# EAGLE design OpenBook (EAGLE 9.7.0)
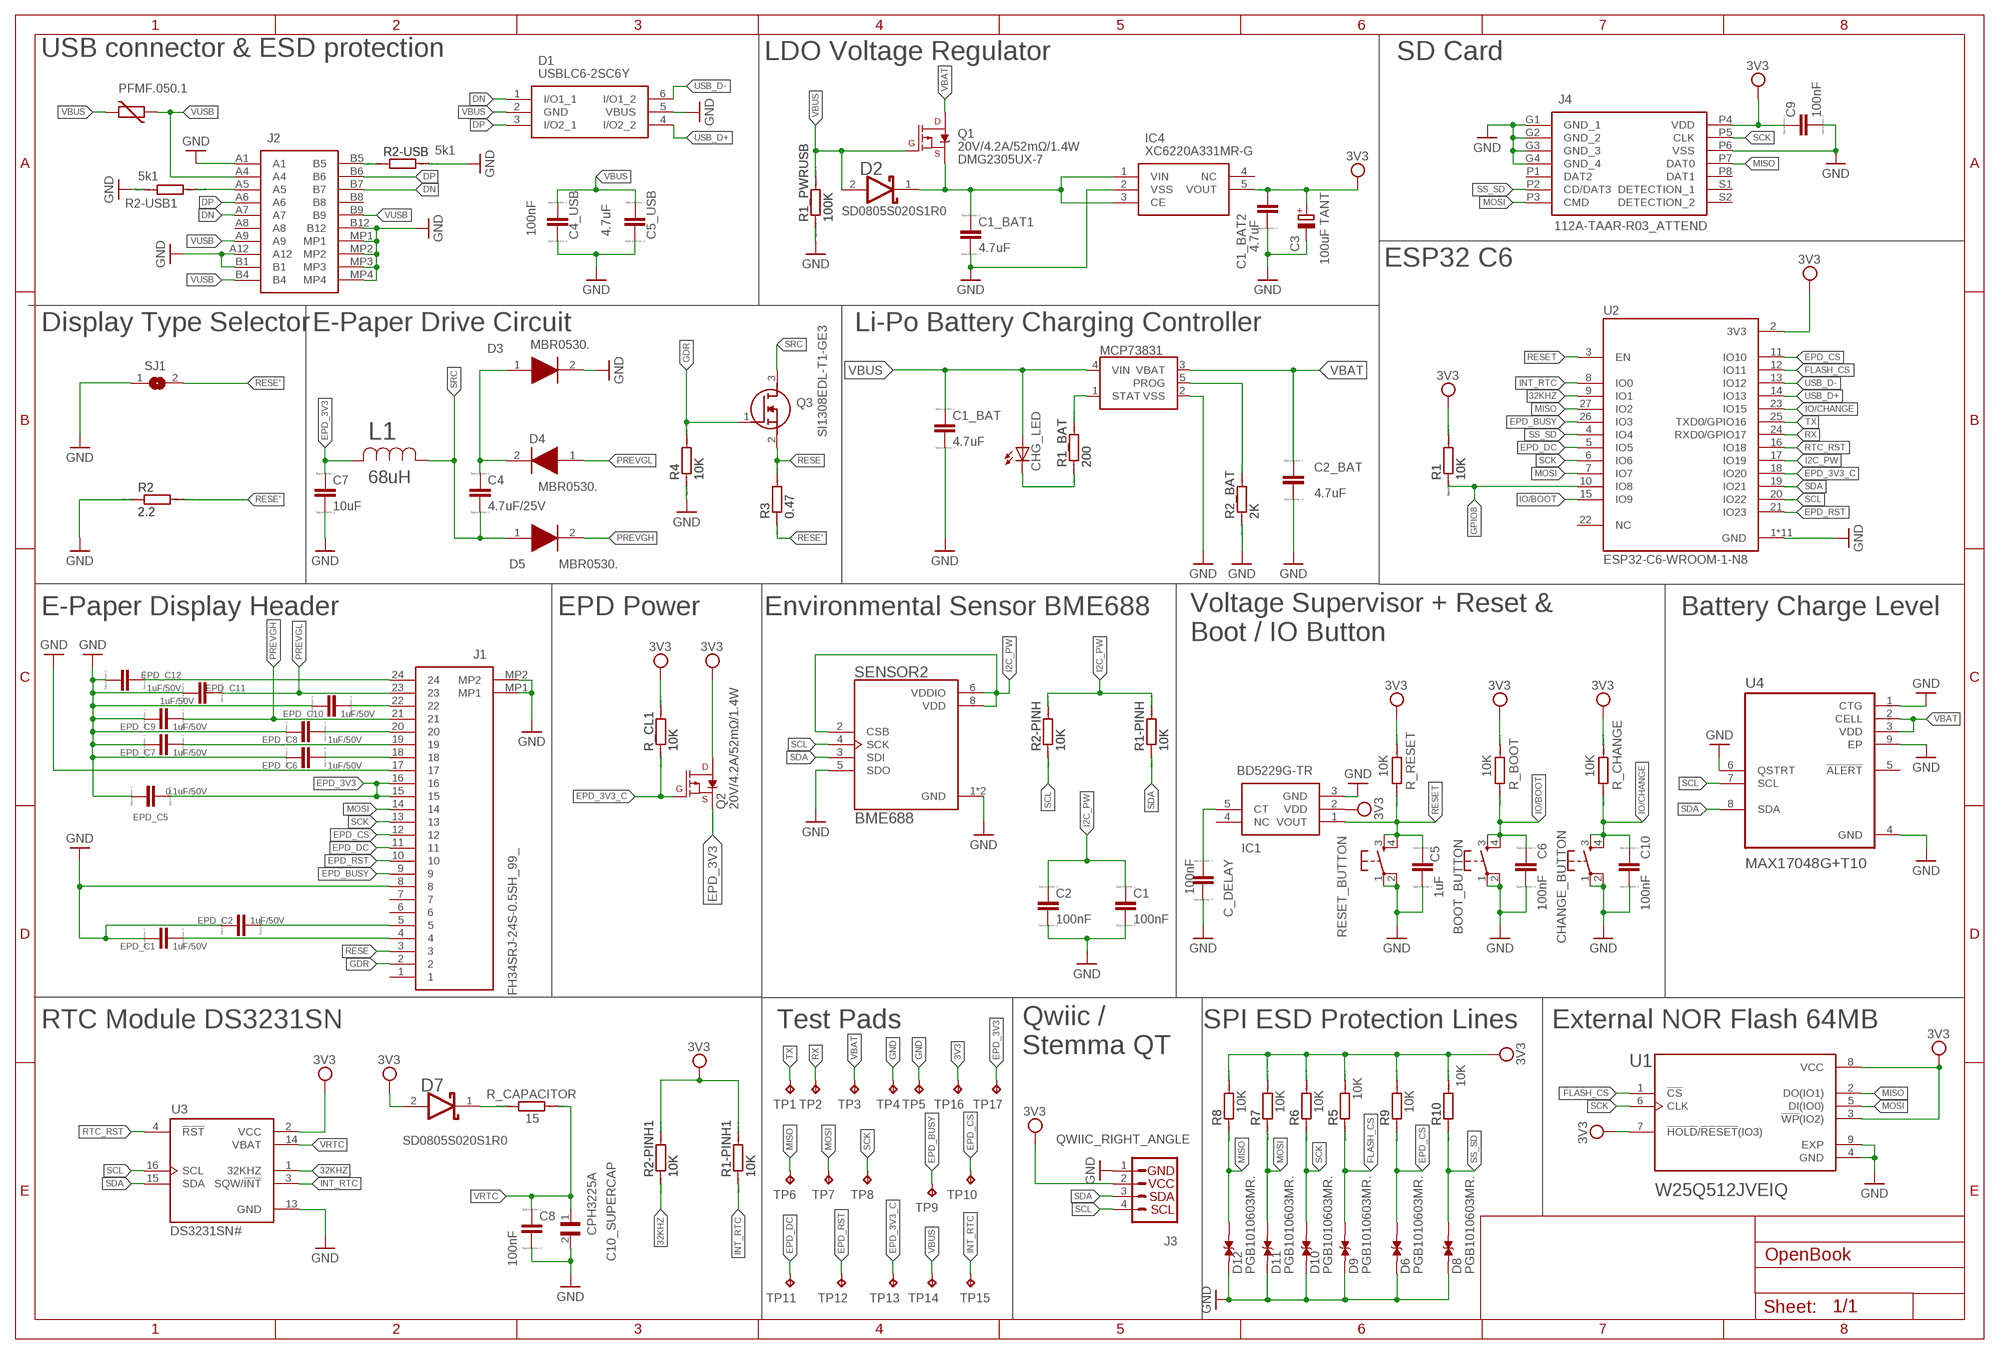
[diagram p0: schematic, sheet 1]

## Parts
BOOT_BUTTON  BUTTON_CUSYOMV1V2  [MYBUTTON]
C1  100nF  EAGLE-LTSPICE_C  [EAGLE-LTSPICE_C0402]
C1_BAT  4.7uF  EAGLE-LTSPICE_C  [EAGLE-LTSPICE_C0402]
C1_BAT1  4.7uF  EAGLE-LTSPICE_C  [EAGLE-LTSPICE_C0402]
C1_BAT2  4.7uF  EAGLE-LTSPICE_C  [EAGLE-LTSPICE_C0402]
C2  100nF  EAGLE-LTSPICE_C  [EAGLE-LTSPICE_C0402]
C2_BAT  4.7uF  EAGLE-LTSPICE_C  [EAGLE-LTSPICE_C0402]
C3  100uF TANT  RCL_CPOL-EUCT3528  [RCL_CT3528]
C4  4.7uF/25V  EAGLE-LTSPICE_C  [EAGLE-LTSPICE_C0402]
C4_USB  100nF  EAGLE-LTSPICE_C  [EAGLE-LTSPICE_C0402]
C5  1uF  EAGLE-LTSPICE_C  [EAGLE-LTSPICE_C0402]
C5_USB  4.7uF  EAGLE-LTSPICE_C  [EAGLE-LTSPICE_C0402]
C6  100nF  EAGLE-LTSPICE_C  [EAGLE-LTSPICE_C0402]
C7  10uF  EAGLE-LTSPICE_C  [EAGLE-LTSPICE_C0402]
C8  100nF  EAGLE-LTSPICE_C  [EAGLE-LTSPICE_C0402]
C9  100nF  EAGLE-LTSPICE_C  [EAGLE-LTSPICE_C0402]
C10  100nF  EAGLE-LTSPICE_C  [EAGLE-LTSPICE_C0402]
C10_SUPERCAP  CPH3225A  [CAPCP3225X100N]
C_DELAY  100nF  EAGLE-LTSPICE_C  [EAGLE-LTSPICE_C0402]
CHANGE_BUTTON  BUTTON_CUSYOMV1V2  [MYBUTTON]
CHG_LED  ADAFRUIT_LEDCHIP-LED0603  [ADAFRUIT_CHIP-LED0603]
D1  USBLC6-2SC6Y  [SOT95P280X145-6N]
D2  SD0805S020S1R0  ESP32_WROVER_AVX---SD0805S020S1R0_AVX_SD0805S020S1R0_0_0AVX_SD0805S020S1R0_0_0  [ESP32_WROVER_AVX---SD0805S020S1R0_AVX_SD0805S020S1R0_0]
D3  MBR0530.  [SOD3716X135N]
D4  MBR0530.  [SOD3716X135N]
D5  MBR0530.  [SOD3716X135N]
D6  PGB1010603MR.  [DIOC1608X36N]
D7  SD0805S020S1R0  ESP32_WROVER_AVX---SD0805S020S1R0_AVX_SD0805S020S1R0_0_0AVX_SD0805S020S1R0_0_0  [ESP32_WROVER_AVX---SD0805S020S1R0_AVX_SD0805S020S1R0_0]
D8  PGB1010603MR.  [DIOC1608X36N]
D9  PGB1010603MR.  [DIOC1608X36N]
D10  PGB1010603MR.  [DIOC1608X36N]
D11  PGB1010603MR.  [DIOC1608X36N]
D12  PGB1010603MR.  [DIOC1608X36N]
EPD_C1  1uF/50V  EAGLE-LTSPICE_C  [EAGLE-LTSPICE_C0402]
EPD_C2  1uF/50V  EAGLE-LTSPICE_C  [EAGLE-LTSPICE_C0402]
EPD_C5  0.1uF/50V  EAGLE-LTSPICE_C  [EAGLE-LTSPICE_C0402]
EPD_C6  1uF/50V  EAGLE-LTSPICE_C  [EAGLE-LTSPICE_C0402]
EPD_C7  1uF/50V  EAGLE-LTSPICE_C  [EAGLE-LTSPICE_C0402]
EPD_C8  1uF/50V  EAGLE-LTSPICE_C  [EAGLE-LTSPICE_C0402]
EPD_C9  1uF/50V  EAGLE-LTSPICE_C  [EAGLE-LTSPICE_C0402]
EPD_C10  1uF/50V  EAGLE-LTSPICE_C  [EAGLE-LTSPICE_C0402]
EPD_C11  1uF/50V  EAGLE-LTSPICE_C  [EAGLE-LTSPICE_C0402]
EPD_C12  1uF/50V  EAGLE-LTSPICE_C  [EAGLE-LTSPICE_C0402]
IC1  BD5229G-TR  [SOT95P280X125-5N]
IC4  XC6220A331MR-G  [SOT95P280X120-5N]
J1  FH34SRJ-24S-0.5SH_99_  [FH34SRJ24S05SH99]
J2  SAMACSYS_PARTS_USB4110-GF-A  [SAMACSYS_PARTS_USB4110GFA]
J3  QWIIC_RIGHT_ANGLE  QWIIC_CONNECTORJS-1MM  [JST04_1MM_RA]
J4  112A-TAAR-R03_ATTEND  [112ATAARR03ATTEND]
L1  68uH  744043680IND_4828-WE-TPC_WRE  [IND_4828-WE-TPC_WRE]
MCP73831  ESP32_WROVER_SPARKFUN-IC-POWER_MCP73831  [ESP32_WROVER_SPARKFUN-IC-POWER_SOT23-5]
PFMF.050.1  ESP32C6_VARISTORCN1812  [ESP32C6_VARISTOR_CT/CN1812]
Q1  20V/4.2A/52mΩ/1.4W  ESP32_WROVER_SPARKFUN-DISCRETESEMI_MOSFET_PCH-DMG2305UX-7  [ESP32_WROVER_SPARKFUN-DISCRETESEMI_SOT23-3]
Q2  20V/4.2A/52mΩ/1.4W  ESP32_WROVER_SPARKFUN-DISCRETESEMI_MOSFET_PCH-DMG2305UX-7  [ESP32_WROVER_SPARKFUN-DISCRETESEMI_SOT23-3]
Q3  SI1308EDL-T1-GE3  [SOT65P210X110-3N]
R1  10K  ESP32_WROVER_EAGLE-LTSPICE_R  [ESP32_WROVER_EAGLE-LTSPICE_R0402]
R1-PINH  10K  ESP32_WROVER_EAGLE-LTSPICE_R  [ESP32_WROVER_EAGLE-LTSPICE_R0402]
R1-PINH1  10K  ESP32_WROVER_EAGLE-LTSPICE_R  [ESP32_WROVER_EAGLE-LTSPICE_R0402]
R1_BAT  200  ESP32_WROVER_EAGLE-LTSPICE_R  [ESP32_WROVER_EAGLE-LTSPICE_R0402]
R1_PWRUSB  100K  ESP32_WROVER_EAGLE-LTSPICE_R  [ESP32_WROVER_EAGLE-LTSPICE_R0402]
R2  2.2  ESP32_WROVER_EAGLE-LTSPICE_R  [ESP32_WROVER_EAGLE-LTSPICE_R0402]
R2-PINH  10K  ESP32_WROVER_EAGLE-LTSPICE_R  [ESP32_WROVER_EAGLE-LTSPICE_R0402]
R2-PINH1  10K  ESP32_WROVER_EAGLE-LTSPICE_R  [ESP32_WROVER_EAGLE-LTSPICE_R0402]
R2-USB  5k1  ESP32_WROVER_EAGLE-LTSPICE_R  [ESP32_WROVER_EAGLE-LTSPICE_R0402]
R2-USB1  5k1  ESP32_WROVER_EAGLE-LTSPICE_R  [ESP32_WROVER_EAGLE-LTSPICE_R0402]
R2_BAT  2K  ESP32_WROVER_EAGLE-LTSPICE_R  [ESP32_WROVER_EAGLE-LTSPICE_R0402]
R3  0.47  ESP32_WROVER_EAGLE-LTSPICE_R  [ESP32_WROVER_EAGLE-LTSPICE_R0402]
R4  10K  ESP32_WROVER_EAGLE-LTSPICE_R  [ESP32_WROVER_EAGLE-LTSPICE_R0402]
R5  10K  ESP32_WROVER_EAGLE-LTSPICE_R  [ESP32_WROVER_EAGLE-LTSPICE_R0402]
R6  10K  ESP32_WROVER_EAGLE-LTSPICE_R  [ESP32_WROVER_EAGLE-LTSPICE_R0402]
R7  10K  ESP32_WROVER_EAGLE-LTSPICE_R  [ESP32_WROVER_EAGLE-LTSPICE_R0402]
R8  10K  ESP32_WROVER_EAGLE-LTSPICE_R  [ESP32_WROVER_EAGLE-LTSPICE_R0402]
R9  10K  ESP32_WROVER_EAGLE-LTSPICE_R  [ESP32_WROVER_EAGLE-LTSPICE_R0402]
R10  10K  ESP32_WROVER_EAGLE-LTSPICE_R  [ESP32_WROVER_EAGLE-LTSPICE_R0402]
R_BOOT  10K  ESP32_WROVER_EAGLE-LTSPICE_R  [ESP32_WROVER_EAGLE-LTSPICE_R0402]
R_CAPACITOR  15  ESP32_WROVER_EAGLE-LTSPICE_R  [ESP32_WROVER_EAGLE-LTSPICE_R0402]
R_CHANGE  10K  ESP32_WROVER_EAGLE-LTSPICE_R  [ESP32_WROVER_EAGLE-LTSPICE_R0402]
R_CL1  10K  ESP32_WROVER_EAGLE-LTSPICE_R  [ESP32_WROVER_EAGLE-LTSPICE_R0402]
R_RESET  10K  ESP32_WROVER_EAGLE-LTSPICE_R  [ESP32_WROVER_EAGLE-LTSPICE_R0402]
RESET_BUTTON  BUTTON_CUSYOMV1V2  [MYBUTTON]
SENSOR2  BME688  ESP32_WROVER_BME680_BME680  [ESP32_WROVER_BME680_PSON80P300X300X100-8N]
SJ1  SJ  [SJ]
TP1  TPV1  [TP20R]
TP2  TPV1  [TP20R]
TP3  TPV1  [TP20R]
TP4  TPV1  [TP20R]
TP5  TPV1  [TP20R]
TP6  TPV1  [TP20R]
TP7  TPV1  [TP20R]
TP8  TPV1  [TP20R]
TP9  TPV1  [TP20R]
TP10  TPV1  [TP20R]
TP11  TPV1  [TP20R]
TP12  TPV1  [TP20R]
TP13  TPV1  [TP20R]
TP14  TPV1  [TP20R]
TP15  TPV1  [TP20R]
TP16  TPV1  [TP20R]
TP17  TPV1  [TP20R]
U1  W25Q512JVEIQ  [SON127P600X800X80-9N]
U2  ESP32-C6-WROOM-1-N8  [XCVR_ESP32-C6-WROOM-1-N8]
U3  DS3231SN#  [SOIC127P1032X265-16N]
U4  MAX17048G+T10  [SON50P200X200X80-9N]

## Nets
3V3 [Alimentare]: C1_BAT2.1 C3.+ C9.1 D7.2(ANODE) IC1.2(VDD) IC4.5(VOUT) J3.2 J4.P4(VDD) Q2.3(D) R1-PINH1.2 R1.2 R2-PINH1.2 R5.2 R6.2 R7.2 R8.2 R9.2 R10.2 R_BOOT.2 R_CHANGE.2 R_CL1.2 R_RESET.2 TP16.TP U1.3(!WP!(IO2)) U1.7(!HOLD!/!RESET!(IO3)) U1.8(VCC) U2.2(3V3) U3.2(VCC)
32KHZ: R2-PINH1.1 U2.9(IO1) U3.1(32KHZ)
DN: D1.1(I/O1_1) J2.A7 J2.B7
DP: D1.3(I/O2_1) J2.A6 J2.B6
EPD_3V3 [Alimentare]: C7.1 EPD_C5.2 J1.15 J1.16 L1.2 Q2.2(S) TP17.TP
EPD_3V3_C [Alimentare]: Q2.1(G) R_CL1.1 TP13.TP U2.18(IO20)
EPD_BUSY: J1.9 TP9.TP U2.26(IO3)
EPD_CS: D6.2 J1.12 R9.1 TP10.TP U2.11(IO10)
EPD_DC: J1.11 TP11.TP U2.5(IO5)
EPD_RST: J1.10 TP12.TP U2.21(IO23)
FLASH_CS: D9.2 R5.1 U1.1(!CS) U2.12(IO11)
GDR: J1.2 Q3.1(G) R4.2
GND: BOOT_BUTTON.1 BOOT_BUTTON.2 C1.2 C1_BAT1.2 C1_BAT2.2 C1_BAT.2 C2.2 C2_BAT.2 C3.- C4_USB.2 C5.2 C5_USB.2 C6.2 C7.2 C8.2 C9.2 C10.2 C10_SUPERCAP.2 C_DELAY.2 CHANGE_BUTTON.1 CHANGE_BUTTON.2 D1.5(VBUS) D3.2(K) D6.1 D8.1 D9.1 D10.1 D11.1 D12.1 EPD_C1.1 EPD_C2.1 EPD_C5.1 EPD_C6.1 EPD_C7.1 EPD_C8.1 EPD_C9.1 EPD_C10.1 EPD_C11.1 EPD_C12.1 IC1.3(GND) IC4.2(VSS) J1.8 J1.17 J1.MP1 J1.MP2 J2.A1 J2.A12 J2.B1 J2.B12 J2.MP1 J2.MP2 J2.MP3 J2.MP4 J3.1 J4.G1(GND_1) J4.G2(GND_2) J4.G3(GND_3) J4.G4(GND_4) J4.P6(VSS) MCP73831.2(VSS) R1_PWRUSB.1 R2-USB1.1 R2-USB.2 R2.1 R2_BAT.1 R4.1 RESET_BUTTON.1 RESET_BUTTON.2 SENSOR2.1(GND) SENSOR2.5(SDO) SENSOR2.7(GND) SJ1.1 TP4.TP TP5.TP U1.4(GND) U1.9(EXP) U2.1(GND) U2.28(GND) U2.29_1(GND) U2.29_2(GND) U2.29_3(GND) U2.29_4(GND) U2.29_5(GND) U2.29_6(GND) U2.29_7(GND) U2.29_8(GND) U2.29_9(GND) U3.13(GND) U4.1(CTG) U4.4(GND) U4.6(QSTRT) U4.9(EP)
GPIO8: R1.1 U2.10(IO8)
I2C_PW: C1.1 C2.1 R1-PINH.2 R2-PINH.2 SENSOR2.2(CSB) SENSOR2.6(VDDIO) SENSOR2.8(VDD) U2.17(IO19)
INT_RTC: R1-PINH1.1 TP15.TP U2.8(IO0) U3.3(SQW/!INT)
IO/BOOT: BOOT_BUTTON.3 BOOT_BUTTON.4 C6.1 R_BOOT.1 U2.15(IO9)
IO/CHANGE: C10.1 CHANGE_BUTTON.3 CHANGE_BUTTON.4 R_CHANGE.1 U2.23(IO15)
MISO: D12.2 J4.P7(DAT0) R8.1 TP6.TP U1.2(DO(IO1)) U2.27(IO2)
MOSI: D11.2 J1.14 J4.P3(CMD) R7.1 TP7.TP U1.5(DI(IO0)) U2.7(IO7)
N$1: D7.1(CATHODE) R_CAPACITOR.1
N$2: J2.A5 R2-USB1.2
N$3: J2.B5 R2-USB.1
N$4: C4.1 D3.1(A) D4.2(K)
N$5: C1_BAT1.1 D2.1(CATHODE) IC4.1(VIN) IC4.3(CE) Q1.2(S)
N$7: MCP73831.1(STAT) R1_BAT.2
N$8: MCP73831.5(PROG) R2_BAT.2
N$9: C_DELAY.1 IC1.5(CT)
N$10: CHG_LED.C R1_BAT.1
N$13: EPD_C1.2 J1.4
N$14: EPD_C2.2 J1.5
N$15: EPD_C6.2 J1.18
N$16: EPD_C7.2 J1.19
N$17: EPD_C10.2 J1.22
N$18: EPD_C8.2 J1.20
N$23: EPD_C12.2 J1.24
PREVGH: D5.2(K) EPD_C9.2 J1.21
PREVGL: D4.1(A) EPD_C11.2 J1.23
RESE: J1.3 Q3.2(S) R3.2
RESE': R2.2 R3.1 SJ1.2
RESET: C5.1 IC1.1(VOUT) R_RESET.1 RESET_BUTTON.3 RESET_BUTTON.4 U2.3(EN)
RTC_RST: U2.16(IO18) U3.4(!RST)
RX: TP2.TP U2.24(RXD0/GPIO17)
SCK: D10.2 J1.13 J4.P5(CLK) R6.1 TP8.TP U1.6(CLK) U2.6(IO6)
SCL: J3.4 R2-PINH.1 SENSOR2.4(SCK) U2.20(IO22) U3.16(SCL) U4.7(SCL)
SDA: J3.3 R1-PINH.1 SENSOR2.3(SDI) U2.19(IO21) U3.15(SDA) U4.8(SDA)
SRC: C4.2 D5.1(A) L1.1 Q3.3(D)
SS_SD: D8.2 J4.P2(CD/DAT3) R10.1 U2.4(IO4)
TX: TP1.TP U2.25(TXD0/GPIO16)
USB_D+: D1.4(I/O2_2) U2.14(IO13)
USB_D-: D1.6(I/O1_2) U2.13(IO12)
VBAT: C2_BAT.1 MCP73831.3(VBAT) Q1.3(D) TP3.TP U4.2(CELL) U4.3(VDD)
VBUS [Alimentare]: C1_BAT.1 C4_USB.1 C5_USB.1 CHG_LED.A D1.2(GND) D2.2(ANODE) MCP73831.4(VIN) PFMF.050.1.2 Q1.1(G) R1_PWRUSB.2 TP14.TP
VRTC: C8.1 C10_SUPERCAP.1 R_CAPACITOR.2 U3.14(VBAT)
VUSB [Alimentare]: J2.A4 J2.A9 J2.B4 J2.B9 PFMF.050.1.1
Unconnected: IC1.4(NC) IC4.4(NC) J1.1 J1.6 J1.7 J2.A8 J2.B8 J4.P1(DAT2) J4.P8(DAT1) J4.S1(DETECTION_1) J4.S2(DETECTION_2) U2.22(NC) U4.5(!ALERT)

## Notes on the sheet
- LDO Voltage Regulator | SD Card
- USB connector & ESD protection
- DMG2305UX-7
- SD0805S020S1R0
- ESP32 C6
- Display Type Selector | E-Paper Drive Circuit | Li-Po Battery Charging Controller
- E-Paper Display Header | EPD Power | Environmental Sensor BME688 | Battery Charge Level
- Boot / IO Button | Voltage Supervisor + Reset &
- RTC Module DS3231SN | Test Pads | SPI ESD Protection Lines | External NOR Flash 64MB
- Qwiic / | Stemma QT
- SD0805S020S1R0

## Library data of the parts
BOOT_BUTTON CHANGE_BUTTON RESET_BUTTON = Piese_tudose:BUTTON_CUSYOMV1
C1 C1_BAT C1_BAT1 C1_BAT2 C2 C2_BAT C4 C4_USB C5 C5_USB C6-C10 C_DELAY EPD_C1 EPD_C2 EPD_C5-EPD_C12 = Piese_tudose:EAGLE-LTSPICE_C: CAPACITOR, European symbol
C3 = Piese_tudose:RCL_CPOL-EU: POLARIZED CAPACITOR, European symbol; SPICEPREFIX: C
C10_SUPERCAP = Piese_tudose:CPH3225A: Cap 0.011F 3.3V 1210 Flat Check availability <https://pricing.snapeda.com/parts/CPH3225A/Seiko%20Instruments/view-part?ref=eda>; AVAILABILITY: Not in stock; CHECK_PRICES: https://www.snapeda.com/parts/CPH3225A/Seiko+Instruments/view-part/?ref=eda; DESCRIPTION: 11 mF (EDLC) Supercapacitor 3.3 V 1210 (3225 Metric) - -; MF: Seiko Instruments; MP: CPH3225A; PACKAGE: 1210 Seiko; PRICE: None; PURCHASE-URL: https://www.snapeda.com/api/url_track_click_mouser/?unipart_id=562593&manufacturer=Seiko Instruments&part_name=CPH3225A&search_term=None; SNAPEDA_LINK: https://www.snapeda.com/parts/CPH3225A/Seiko+Instruments/view-part/?ref=snap
CHG_LED = Piese_tudose:ADAFRUIT_LED: LED OSRAM: - CHIPLED LG R971, LG N971, LY N971, LG Q971, LY Q971, LO R971, LY R971 LH N974, LH R974 LS Q976, LO Q976, LY Q976 LO Q996 - Hyper CHIPLED LW Q18S LB Q993, LB Q99A, LB R99A - SideLED LS A670, LO A670, LY A670, LG A670, LP A670 LB A673, LV A673, LT A673, LW A673 LH A674 LY A675 LS A676, LA A676, LO A676, LY A676, LW A676 LS A679, LY A679, LG A679 - Hyper Micro SIDELED® LS Y876, LA Y876, LO Y876, LY Y876 LT Y87S - SmartLED LW L88C, LW L88S LB L89C, LB L89S, LG L890 LS L89K, LO L89K, LY L89K LS L896, LA L896, LO L896, LY L896 - TOPLED LS T670, LO T670, LY T670, LG T670, LP T670 LSG T670, LSP T670, LSY T670, LOP T670, LYG T670 LG T671, LOG T671, LSG T671 LB T673, LV T673, LT T673, LW T673 LH T674 LS T676, LA T676, LO T676, LY T676, LB T676, LH T676, LSB T676, LW T676 LB T67C, LV T67C, LT T67C, LS T67K, LO T67K, LY T67K, LW E67C LS E67B, LA E67B, LO E67B, LY E67B, LB E67C, LV E67C, LT E67C LW T67C LS T679, LY T679, LG T679 LS T770, LO T770, LY T770, LG T770, LP T770 LB T773, LV T773, LT T773, LW T773 LH T774 LS E675, LA E675, LY E675, LS T675 LS T776, LA T776, LO T776, LY T776, LB T776 LHGB T686 LT T68C, LB T68C - Hyper Mini TOPLED® LB M676 - Mini TOPLED Santana® LG M470 LS M47K, LO M47K, LY M47K Source: http://www.osram.convergy.de/
D1 = Piese_tudose:USBLC6-2SC6Y: Low Cap. ESD Protection Auto SOT-23-6 STMicroelectronics USBLC6-2SC6Y, Dual Uni-Directional TVS Diode Array, 6-Pin SOT-23 Source: Datasheet <https://componentsearchengine.com/Datasheets/1/USBLC6-2SC6Y.pdf> Check availability <https://pricing.snapeda.com/parts/USBLC6-2SC6Y/STMicroelectronics/view-part?ref=eda>; AVAILABILITY: In Stock; CHECK_PRICES: https://www.snapeda.com/parts/USBLC6-2SC6Y/STMicroelectronics/view-part/?ref=eda; DESCRIPTION: 17V Clamp 5A (8/20µs) Ipp Tvs Diode Surface Mount SOT-23-6; MF: STMicroelectronics; MP: USBLC6-2SC6Y; PACKAGE: SOT-23-6 STMicroelectronics; PRICE: None; SNAPEDA_LINK: https://www.snapeda.com/parts/USBLC6-2SC6Y/STMicroelectronics/view-part/?ref=snap
D2 D7 = Piese_tudose:ESP32_WROVER_AVX---SD0805S020S1R0_AVX_SD0805S020S1R0_0_0: Schottky Barrier Rectifier Diode; CENTROID_NOT_SPECIFIED: No; DATASHEET: http://datasheets.avx.com/schottky.pdf; DIGIKEY_DESCRIPTION: DIODE SCHOTTKY 20V 1A 0805; DIGIKEY_PART_NUMBER: 478-7800-1-ND; LEAD_FREE: yes; MF: AVX; MOUSER_PART_NUMBER: 581-SD0805S020S1R0; PACKAGE: 0805 (2012 metric); PREFIX: D; ROHS: yes; TEMPERATURE_RANGE_HIGH: +125°C; TEMPERATURE_RANGE_LOW: -55°C
D3-D5 = Piese_tudose:MBR0530: ON SEMICONDUCTOR - MBR0530 - DIODE, SCHOTTKY, 0.5A, 30V, SOD-123 Source: Datasheet <http://www.onsemi.com/pub/Collateral/MBR0530T1-D.PDF> Check availability <https://pricing.snapeda.com/parts/MBR0530/ON%20Semiconductor/view-part?ref=eda>
D6 D8-D12 = Piese_tudose:PGB1010603MR: Check availability <https://pricing.snapeda.com/parts/PGB1010603MR/Littelfuse%20Inc./view-part?ref=eda>
IC1 = Piese_tudose:BD5229G-TR: Voltage Detector with Adjustable Delay Time: CMOS processes are utilized to develop high precision, low current consumption CMOS reset ICs that allow arbitrary setting of the delay time. The extensive lineup includes both Nch Open Drain and CMOS output types in a wide range of detection voltages (from 2.3V to 6.0V, in 0.1V steps), enabling selection of the ideal solution based on customer requirements. In addition, the entire series is of course both lead-free and RoHS-compliant. Source: Datasheet <https://datasheet.datasheetarchive.com/originals/distributors/Datasheets_SAMA/f2b9741ef86007909f138d561a359946.pdf>; DESCRIPTION: Voltage Detector with Adjustable Delay Time: CMOS processes are utilized to develop high precision, low current consumption CMOS reset ICs that allow arbitrary setting of the delay time. The extensive lineup includes both Nch Open Drain and CMOS output types in a wide range of detection voltages (from 2.3V to 6.0V, in 0.1V steps), enabling selection of the ideal solution based on customer requirements. In addition, the entire series is of course both lead-free and RoHS-compliant.; HEIGHT: 1.25mm; MANUFACTURER_NAME: ROHM Semiconductor; MANUFACTURER_PART_NUMBER: BD5229G-TR; MOUSER_PART_NUMBER: 755-BD5229G-TR; MOUSER_PRICE-STOCK: https://www.mouser.co.uk/ProductDetail/ROHM-Semiconductor/BD5229G-TR?qs=4kLU8WoGk0vvnhrrYwdszw%3D%3D
IC4 = Piese_tudose:XC6220A331MR-G: LDO Voltage Regulators Source: Datasheet <https://www.torexsemi.com/file/xc6220/XC6220.pdf>; DESCRIPTION: LDO Voltage Regulators; HEIGHT: 1.2mm; MANUFACTURER_NAME: Torex; MANUFACTURER_PART_NUMBER: XC6220A331MR-G; MOUSER_PART_NUMBER: 865-XC6220A331MR-G; MOUSER_PRICE-STOCK: https://www.mouser.co.uk/ProductDetail/Torex-Semiconductor/XC6220A331MR-G?qs=AsjdqWjXhJ8ZSWznL1J0gg%3D%3D
J1 = Piese_tudose:FH34SRJ-24S-0.5SH_99_: 24 Position FFC, FPC Connector Contacts, Top and Bottom 0.020" (0.50mm) Surface Mount, Right Angle Source: Datasheet <https://www.hirose.com/en/product/document?clcode=CL0580-1255-6-99&productname=FH34SRJ-24S-0.5SH(99)&series=FH34SRJ&documenttype=2DDrawing&lang=en&documentid=0000990903>; DESCRIPTION: 24 Position FFC, FPC Connector Contacts, Top and Bottom 0.020" (0.50mm) Surface Mount, Right Angle; HEIGHT: 1.1mm; MANUFACTURER_NAME: Hirose; MANUFACTURER_PART_NUMBER: FH34SRJ-24S-0.5SH(99); MOUSER_PART_NUMBER: 798-FH34SRJ24S05SH99; MOUSER_PRICE-STOCK: https://www.mouser.co.uk/ProductDetail/Hirose-Connector/FH34SRJ-24S-0.5SH99?qs=vcbW%252B4%252BSTIpKBl5ap9J8Fw%3D%3D
J2 = Piese_tudose:SAMACSYS_PARTS_USB4110-GF-A: CONN USB 2.0 TYPE-C R/A SMT Source: Datasheet <https://gct.co/files/drawings/usb4110.pdf>; DESCRIPTION: CONN USB 2.0 TYPE-C R/A SMT; HEIGHT: 3.26mm; MANUFACTURER_NAME: GCT (GLOBAL CONNECTOR TECHNOLOGY); MANUFACTURER_PART_NUMBER: USB4110-GF-A; MOUSER_PART_NUMBER: 640-USB4110-GF-A; MOUSER_PRICE-STOCK: https://www.mouser.co.uk/ProductDetail/GCT/USB4110-GF-A?qs=KUoIvG%2F9IlYiZvIXQjyJeA%3D%3D
J3 = Piese_tudose:QWIIC_CONNECTOR: SparkFun I2C Standard Qwiic Connector An SMD 1mm pitch JST connector makes it easy and quick (get it? Qwiic?) to connect I2C devices to each other. The Qwiic system <http://www.sparkfun.com/qwiic> enables fast and solderless connection between popular platforms and various sensors and actuators. We carry 200mm <https://www.sparkfun.com/products/14204>, 100mm <https://www.sparkfun.com/products/14205>, 50mm <https://www.sparkfun.com/products/14206>, and breadboard friendly <https://www.sparkfun.com/products/14207> Qwiic cables. We also offer 10 pcs strips <https://www.sparkfun.com/products/14323> the SMD connectors.; PROD_ID: CONN-13694
J4 = Piese_tudose:112A-TAAR-R03_ATTEND: Micro SD Card Socket, Push-Push Type, Top Mount, SMT, H=1.83mm, 10u Source: Datasheet <https://www.attend.com.tw/data/download/file/112A-TAAR-R03.pdf>; DESCRIPTION: Micro SD Card Socket, Push-Push Type, Top Mount, SMT, H=1.83mm, 10u; HEIGHT: 1.9mm; MANUFACTURER_NAME: ATTEND; MANUFACTURER_PART_NUMBER: 112A-TAAR-R03 ATTEND
L1 = Piese_tudose:744043680; COPYRIGHT: Copyright (C) 2024 Ultra Librarian. All rights reserved.; MANUFACTURER_PART_NUMBER: 744043680; MFR_NAME: Wurth Electronics
MCP73831 = Piese_tudose:ESP32_WROVER_SPARKFUN-IC-POWER_MCP73831: MCP73831T Li-Ion, Li-Pol Controller Miniature single cell, fully integrated Li-Ion, Li-polymer charge management controller Datasheet <http://ww1.microchip.com/downloads/en/DeviceDoc/20001984g.pdf> SparkFun Products: SparkFun ESP32 Thing <https://www.sparkfun.com/products/13907> SparkFun 9DoF Razor IMU M0 <https://www.sparkfun.com/products/14001>; PROD_ID: IC-09995
PFMF.050.1 = Piese_tudose:ESP32C6_VARISTOR: VARISTOR
Q1 Q2 = Piese_tudose:ESP32_WROVER_SPARKFUN-DISCRETESEMI_MOSFET_PCH: P-channel MOSFETs Voltage controlled devices that allow control of high current outputs. SparkFun Products: SparkFun ESP32 Thing <https://www.sparkfun.com/products/13907> SparkFun ESP8266 Thing <https://www.sparkfun.com/products/13231> SparkFun Pi Servo HAT V2 <https://www.sparkfun.com/products/15316> DMG2305UX-7 (20V/4.2A/SOT23-3); PROD_ID: TRAN-14388
Q3 = Piese_tudose:SI1308EDL-T1-GE3: MOSFET N-Ch 30V 1.5A TrenchFET SC70 Vishay Si1308EDL-T1-GE3 N-channel MOSFET Transistor, 1.5 A, 30 V, 3-Pin SC-70 Source: Datasheet <https://componentsearchengine.com/Datasheets/1/SI1308EDL-T1-GE3.pdf> Check availability <https://pricing.snapeda.com/parts/SI1308EDL-T1-GE3/Vishay%20Siliconix/view-part?ref=eda>; AVAILABILITY: In Stock; CHECK_PRICES: https://www.snapeda.com/parts/SI1308EDL-T1-GE3/Vishay+Siliconix/view-part/?ref=eda; DESCRIPTION: Si1308EDL-T1-GE3 N-channel MOSFET Transistor, 1.5 A, 30 V, 3-Pin SC-70 | Siliconix / Vishay SI1308EDL-T1-GE3; MF: Vishay Siliconix; MP: SI1308EDL-T1-GE3; PACKAGE: SOT-323 Vishay Semiconductor; PRICE: None; PURCHASE-URL: https://www.snapeda.com/api/url_track_click_mouser/?unipart_id=274603&manufacturer=Vishay Siliconix&part_name=SI1308EDL-T1-GE3&search_term=None; SNAPEDA_LINK: https://www.snapeda.com/parts/SI1308EDL-T1-GE3/Vishay+Siliconix/view-part/?ref=snap
R1 R1-PINH R1-PINH1 R1_BAT R1_PWRUSB R2 R2-PINH R2-PINH1 R2-USB R2-USB1 R2_BAT R3-R10 R_BOOT R_CAPACITOR R_CHANGE R_CL1 R_RESET = Piese_tudose:ESP32_WROVER_EAGLE-LTSPICE_R: RESISTOR, European symbol
SENSOR2 = Piese_tudose:ESP32_WROVER_BME680_BME680: Integrated Environmental Unit; AVAILABILITY: Unavailable; DESCRIPTION: Integrated Environmental Unit; MF: Bosch Sensortec; MP: BME680; PACKAGE: LGA-8 Bosch Tools; PRICE: None
SJ1 = Piese_tudose:SJ: SMD solder JUMPER
TP1-TP17 = Piese_tudose:TP: Test pad
U1 = Piese_tudose:W25Q512JVEIQ: Check availability <https://pricing.snapeda.com/parts/W25Q512JVEIQ/Winbond%20Electronics/view-part?ref=eda>; AVAILABILITY: In Stock; CHECK_PRICES: https://www.snapeda.com/parts/W25Q512JVEIQ/Winbond+Electronics/view-part/?ref=eda; DESCRIPTION: FLASH - NOR Memory IC 512Mb (64M x 8) SPI - Quad I/O 133 MHz 8-WSON (8x6); MF: Winbond Electronics; MP: W25Q512JVEIQ; PACKAGE: Package; PRICE: None; SNAPEDA_LINK: https://www.snapeda.com/parts/W25Q512JVEIQ/Winbond+Electronics/view-part/?ref=snap
U2 = Piese_tudose:ESP32-C6-WROOM-1-N8: Check availability <https://pricing.snapeda.com/parts/ESP32-C6-WROOM-1-N8/Espressif%20Systems/view-part?ref=eda>; AVAILABILITY: In Stock; CHECK_PRICES: https://www.snapeda.com/parts/ESP32-C6-WROOM-1-N8/Espressif+Systems/view-part/?ref=eda; DESCRIPTION: Multiprotocol Modules ESP32-C6 module, Wi-Fi 6 in 2.4 GHz band, Bluetooth 5, Zigbee 3.0 and Thread. ESP34-WROOM Compatible - ENGINEERING SAMPLE; MF: Espressif Systems; MP: ESP32-C6-WROOM-1-N8; PACKAGE: None; PRICE: None; SNAPEDA_LINK: https://www.snapeda.com/parts/ESP32-C6-WROOM-1-N8/Espressif+Systems/view-part/?ref=snap
U3 = Piese_tudose:DS3231SN#: Real Time Clock Serial 16-Pin SOIC W T/R Check availability <https://pricing.snapeda.com/parts/DS3231SN%23/Analog%20Devices/view-part?ref=eda>; AVAILABILITY: In Stock; CHECK_PRICES: https://www.snapeda.com/parts/DS3231SN%23/Analog+Devices/view-part/?ref=eda; DESCRIPTION: Extremely Accurate I²C-Integrated RTC/TCXO/Crystal; MF: Analog Devices; MP: DS3231SN#; PACKAGE: SOIC-16 Maxim; PRICE: None; PURCHASE-URL: https://www.snapeda.com/api/url_track_click_mouser/?unipart_id=99048&manufacturer=Analog Devices&part_name=DS3231SN#&search_term=None; SNAPEDA_LINK: https://www.snapeda.com/parts/DS3231SN%23/Analog+Devices/view-part/?ref=snap
U4 = Piese_tudose:MAX17048G+T10: Check availability <https://pricing.snapeda.com/parts/MAX17048G%2BT10/Analog%20Devices/view-part?ref=eda>; AVAILABILITY: In Stock; CHECK_PRICES: https://www.snapeda.com/parts/MAX17048G+T10/Analog+Devices/view-part/?ref=eda; DESCRIPTION: 3µA 1-Cell/2-Cell Fuel Gauge with ModelGauge; MF: Analog Devices; MP: MAX17048G+T10; PACKAGE: TDFN-8 Maxim; PRICE: None; PURCHASE-URL: https://www.snapeda.com/api/url_track_click_mouser/?unipart_id=329239&manufacturer=Analog Devices&part_name=MAX17048G+T10&search_term=None; SNAPEDA_LINK: https://www.snapeda.com/parts/MAX17048G+T10/Analog+Devices/view-part/?ref=snap

## Net classes
1 Alimentare: width 0.3 mm

## Board
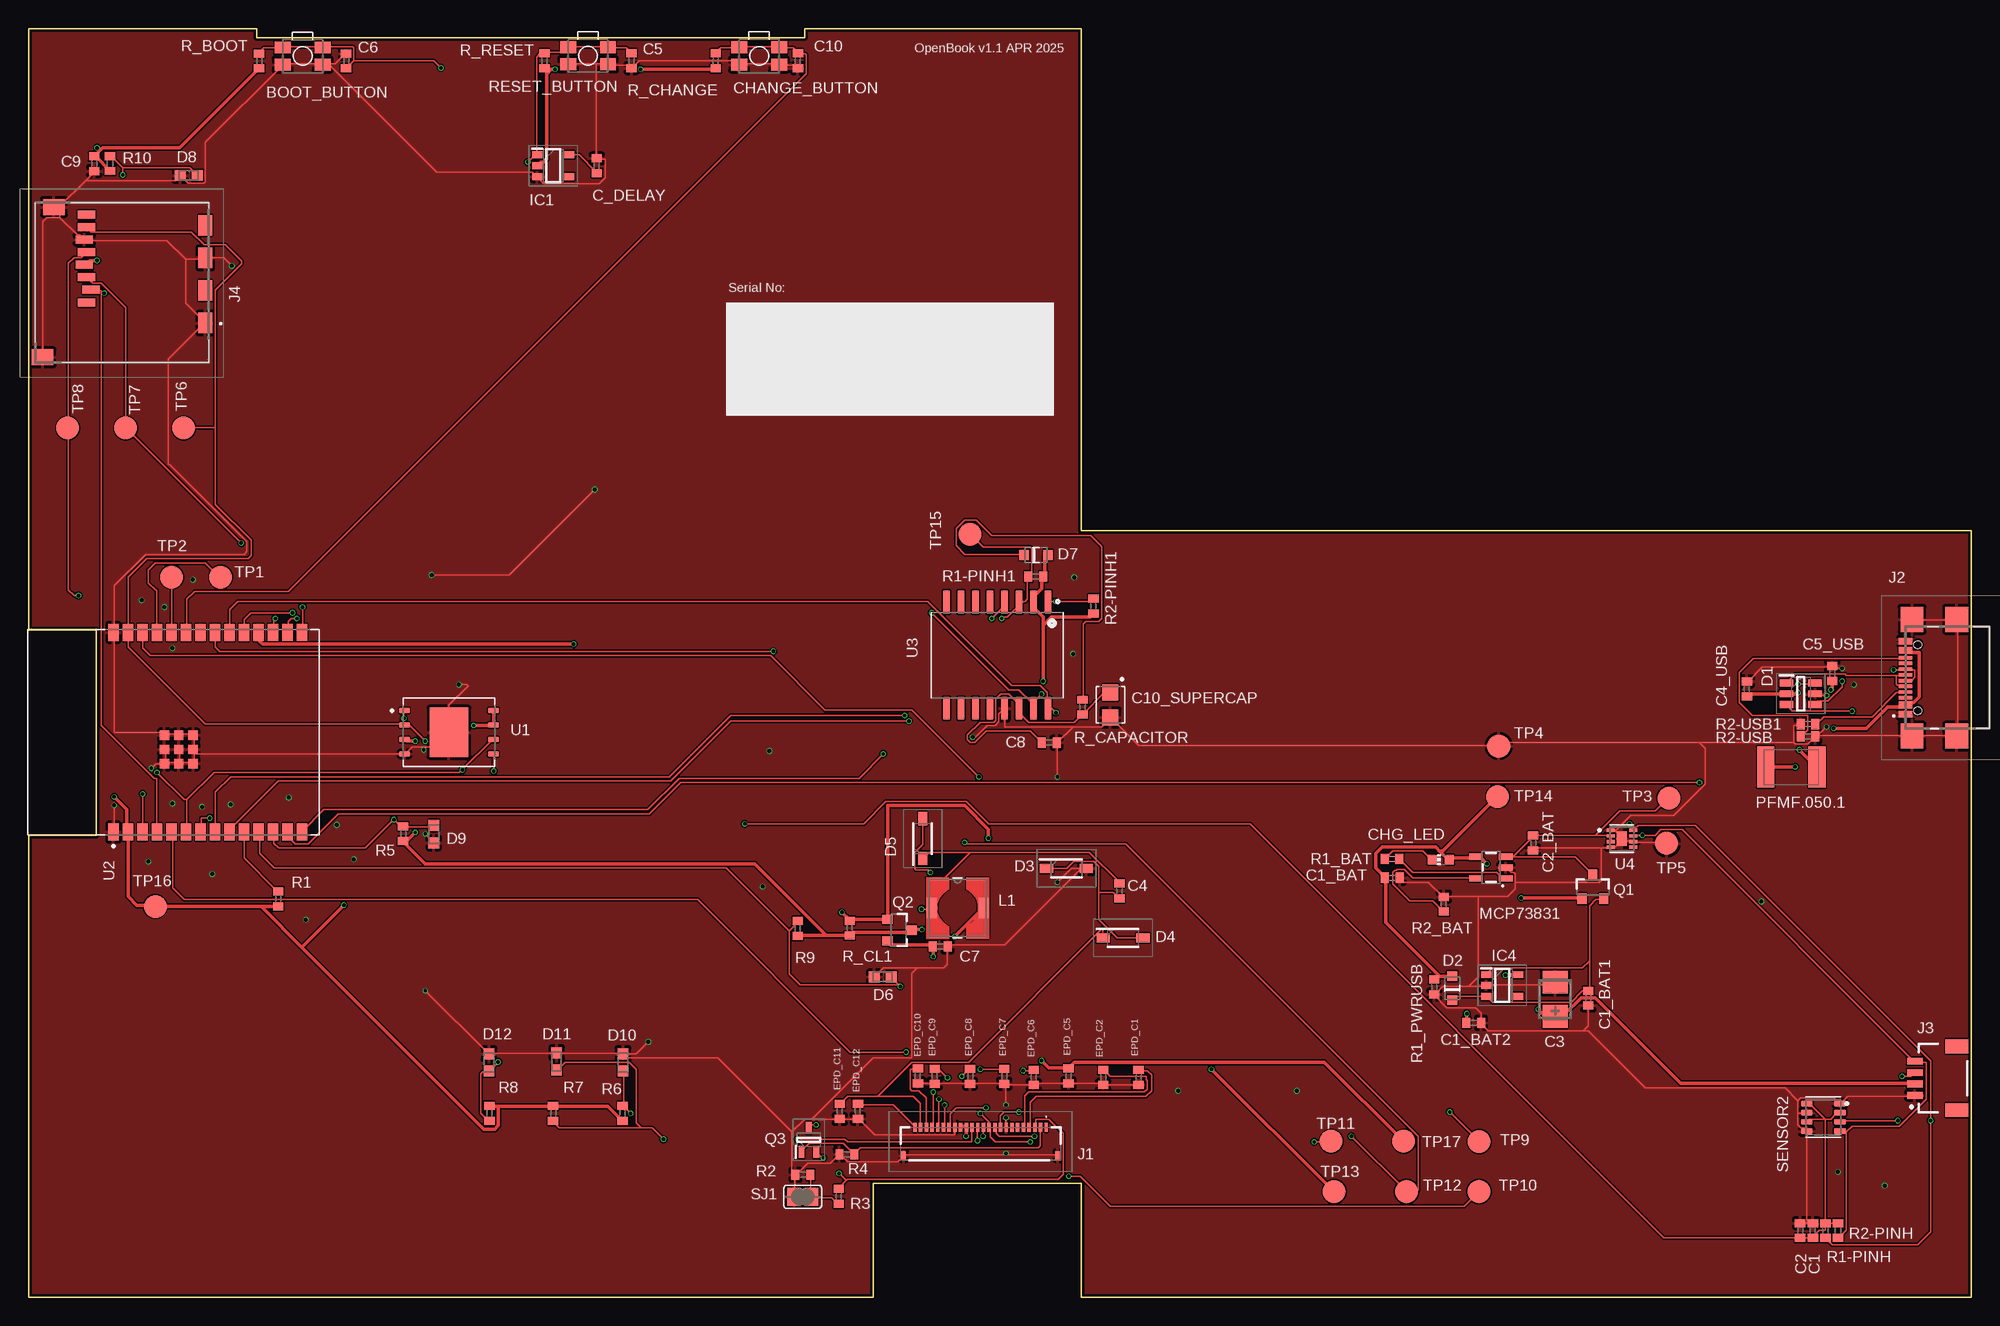
[diagram p1: board, top side]
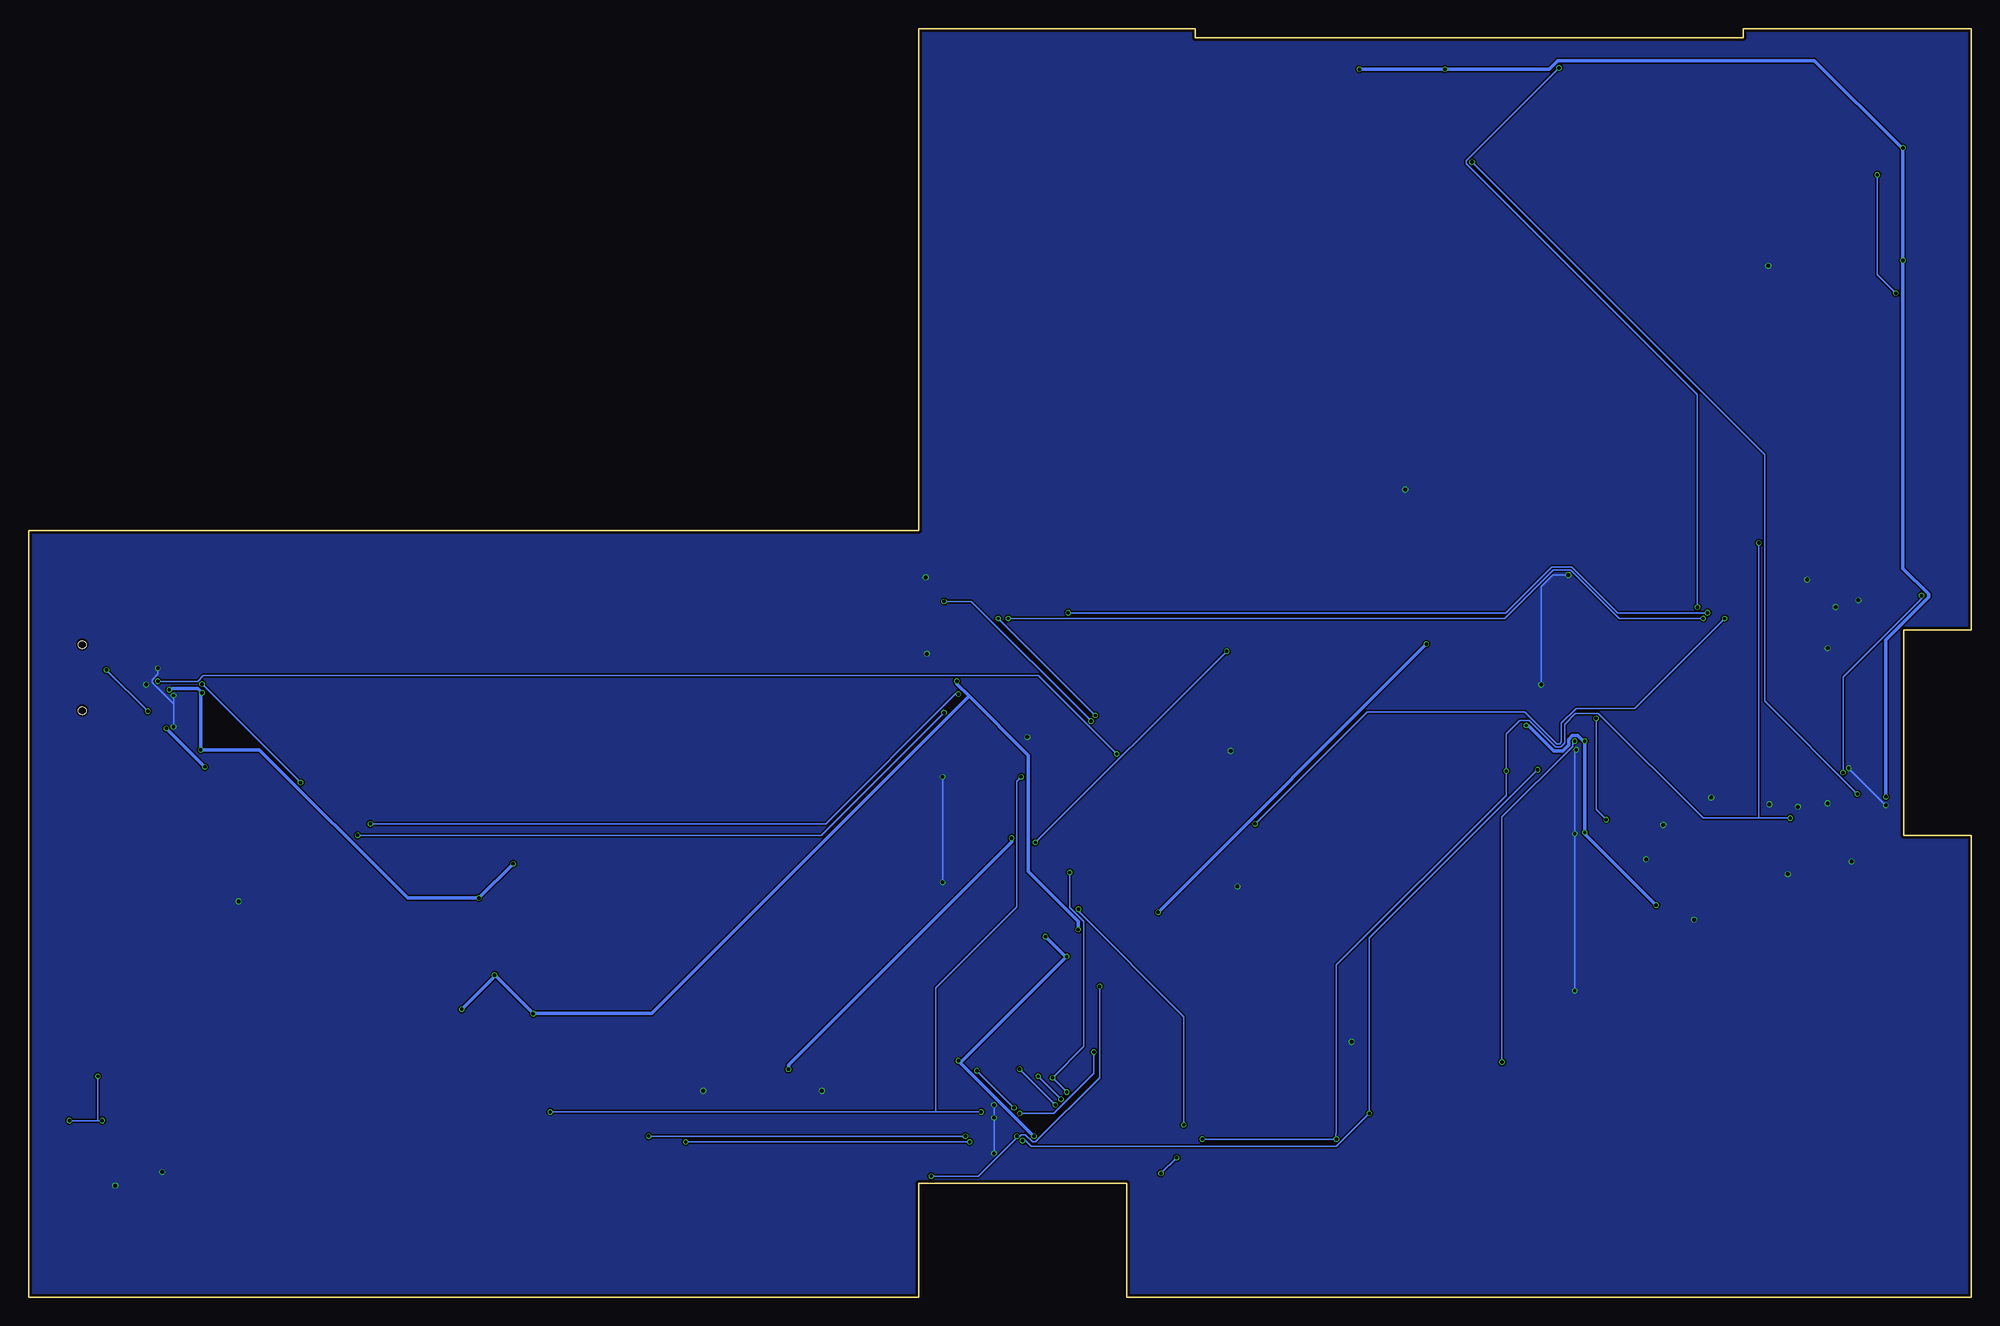
[diagram p2: board, bottom side, seen from below]

Size 170.2 x 111.2 mm. Coordinates in mm from the lower left corner, seen from the top.
Outline: 0,111.2 0,58.51 5.94,58.51 5.94,40.49 0,40.49 0,0 74,0 74,10 92.2,10 92.2,0 170.2,0 170.2,67.2 92.2,67.2 92.2,111.2 68,111.2 68,110.4 20,110.4 20,111.2 0,111.2
Copper layers (1*16): Top 0.035mm / dielectric 1.6mm / Bottom 0.035mm
Design rules "jlcpcb-2layers.dru *": minimum track width 0.15mm, minimum drill 0.3mm, track to track 5mil, track to pad 5mil, pad to pad 5mil, via to via 5mil, smd to smd 5mil, copper to edge 0.2mm, drill to drill 6mil, minimum pad ring 10mil, minimum via ring 3mil, stop-mask expansion 4mil, vias tented up to drill 0mil, thermal gap 10mil

### Footprints (pad centres in the part's own frame; a part is rotated, then mirrored left to right if it is on the bottom)
MYBUTTON = smd 1.4 x 1.05: 1 1.75,0.75; 2 -1.75,0.75; 3 -1.75,-0.75; 4 1.75,-0.75
EAGLE-LTSPICE_C0402 = smd 0.7 x 0.9: 1 -0.65,0; 2 0.65,0
RCL_CT3528 = smd 2 x 2.2: + -1.5,0; - 1.5,0
CAPCP3225X100N = smd 1.4 x 1.4: 1 -1.1,0; 2 1.1,0
ADAFRUIT_CHIP-LED0603 = smd 0.8 x 0.8: A 0,-0.75; C 0,0.75
SOT95P280X145-6N = smd 1.2 x 0.6: 1 -1.25,0.95; 2 -1.25,0; 3 -1.25,-0.95; 4 1.25,-0.95; 5 1.25,0; 6 1.25,0.95
ESP32_WROVER_AVX---SD0805S020S1R0_AVX_SD0805S020S1R0_0 = smd 0.8 x 0.9: 1 -1.05,0; 2 1.05,0
SOD3716X135N = smd 1.15 x 0.8: 1 -1.75,0; 2 1.75,0
DIOC1608X36N = smd 0.97 x 0.94: 1 -0.75,0; 2 0.75,0
SOT95P280X125-5N = smd 0.9 x 0.6: 1 -1.4,0.95; 2 -1.4,0; 3 -1.4,-0.95; 4 1.4,-0.95; 5 1.4,0.95
SOT95P280X120-5N = smd 0.9 x 0.6: 1 -1.4,0.95; 2 -1.4,0; 3 -1.4,-0.95; 4 1.4,-0.95; 5 1.4,0.95
FH34SRJ24S05SH99 = smd 0.3 x 0.8: 1 5.75,1.45; 2 5.25,1.45; 3 4.75,1.45; 4 4.25,1.45; 5 3.75,1.45; 6 3.25,1.45; 7 2.75,1.45; 8 2.25,1.45; 9 1.75,1.45; 10 1.25,1.45; 11 0.75,1.45; 12 0.25,1.45; 13 -0.25,1.45; 14 -0.75,1.45; 15 -1.25,1.45; 16 -1.75,1.45; 17 -2.25,1.45; 18 -2.75,1.45; 19 -3.25,1.45; 20 -3.75,1.45; 21 -4.25,1.45; 22 -4.75,1.45; 23 -5.25,1.45; 24 -5.75,1.45 | smd 0.4 x 0.8: MP1 6.75,-1.05; MP2 -6.75,-1.05
SAMACSYS_PARTS_USB4110GFA = smd 0.3 x 1.15: A1 -3.35,3.678; A4 -2.55,3.678; A5 -1.25,3.678; A6 -0.25,3.678; A7 0.25,3.678; A8 1.25,3.678; A9 2.55,3.678; A12 3.35,3.678; B1 3.05,3.678; B4 2.25,3.678; B5 1.75,3.678; B6 0.75,3.678; B7 -0.75,3.678; B8 -1.75,3.678; B9 -2.25,3.678; B12 -3.05,3.678 | smd 2.18 x 2: MP1 -5.11,-0.827; MP2 5.11,-0.827; MP3 -5.11,3.103; MP4 5.11,3.103 | hole 0.65: -2.89,2.603; 2.89,2.603
JST04_1MM_RA = smd 0.6 x 1.35: 1 -1.5,0; 2 -0.5,0; 3 0.5,0; 4 1.5,0 | smd 1.2 x 2: NC1 2.8,-3.675; NC2 -2.8,-3.675
112ATAARR03ATTEND = smd 1.8 x 1.2: G1 10.6,10.4; G2 4.9,10.4; S1 7.75,10.4; S2 2.05,10.4 | smd 1.4 x 1.9: G3 13.6,-3.85; G4 0.45,-2.85 | smd 0.7 x 1.5: P1 8.8,0; P2 7.7,0.4; P3 6.6,0; P4 5.5,-0.2; P5 4.4,0; P6 3.3,-0.2; P7 2.2,0; P8 1.1,0
IND_4828-WE-TPC_WRE = smd 0.914 x 1.778: 1 -2.286,0; 2 2.286,0
ESP32_WROVER_SPARKFUN-IC-POWER_SOT23-5 = smd 0.55 x 1.2: 1 -0.95,-1.3; 2 0,-1.3; 3 0.95,-1.3; 4 0.95,1.3; 5 -0.95,1.3
ESP32C6_VARISTOR_CT/CN1812 = smd 1.5 x 3.6: 1 -2.25,0; 2 2.25,0
ESP32_WROVER_SPARKFUN-DISCRETESEMI_SOT23-3 = smd 0.8 x 0.9: 1 -0.95,-1; 2 0.95,-1; 3 0,1.1
SOT65P210X110-3N = smd 1.05 x 0.5: 1 -1.05,0.65; 2 -1.05,-0.65; 3 1.05,0
ESP32_WROVER_EAGLE-LTSPICE_R0402 = smd 0.7 x 0.9: 1 -0.65,0; 2 0.65,0
ESP32_WROVER_BME680_PSON80P300X300X100-8N = smd 1.016 x 0.5: 1 1.458,1.2; 2 1.458,0.4; 3 1.458,-0.4; 4 1.458,-1.2; 5 -1.458,-1.22; 6 -1.458,-0.4; 7 -1.458,0.4; 8 -1.458,1.2
SJ = smd 1.168 x 1.6: 1 -0.762,0; 2 0.762,0
TP20R = smd 2 x 2: TP 0,0
SON127P600X800X80-9N = smd 0.94 x 0.44: 1 -3.895,1.905; 2 -3.895,0.635; 3 -3.895,-0.635; 4 -3.895,-1.905; 5 3.895,-1.905; 6 3.895,-0.635; 7 3.895,0.635; 8 3.895,1.905 | smd 3.4 x 4.3: 9 0,0
XCVR_ESP32-C6-WROOM-1-N8 = smd 1.5 x 0.9: 1 -8.75,5.26; 2 -8.75,3.99; 3 -8.75,2.72; 4 -8.75,1.45; 5 -8.75,0.18; 6 -8.75,-1.09; 7 -8.75,-2.36; 8 -8.75,-3.63; 9 -8.75,-4.9; 10 -8.75,-6.17; 11 -8.75,-7.44; 12 -8.75,-8.71; 13 -8.75,-9.98; 14 -8.75,-11.25; 15 8.75,-11.25; 16 8.75,-9.98; 17 8.75,-8.71; 18 8.75,-7.44; 19 8.75,-6.17; 20 8.75,-4.9; 21 8.75,-3.63; 22 8.75,-2.36; 23 8.75,-1.09; 24 8.75,0.18; 25 8.75,1.45; 26 8.75,2.72; 27 8.75,3.99; 28 8.75,5.26 | smd 0.8 x 0.8: 29_1 -2.755,0.79; 29_2 -1.505,0.79; 29_3 -0.255,0.79; 29_4 -2.755,-0.46; 29_5 -1.505,-0.46; 29_6 -0.255,-0.46; 29_7 -2.755,-1.71; 29_8 -1.505,-1.71; 29_9 -0.255,-1.71
SOIC127P1032X265-16N = smd 2.05 x 0.59: 1 -4.655,4.445; 2 -4.655,3.175; 3 -4.655,1.905; 4 -4.655,0.635; 5 -4.655,-0.635; 6 -4.655,-1.905; 7 -4.655,-3.175; 8 -4.655,-4.445; 9 4.655,-4.445; 10 4.655,-3.175; 11 4.655,-1.905; 12 4.655,-0.635; 13 4.655,0.635; 14 4.655,1.905; 15 4.655,3.175; 16 4.655,4.445
SON50P200X200X80-9N = smd 0.76 x 0.27: 1 -0.985,0.75; 2 -0.985,0.25; 3 -0.985,-0.25; 4 -0.985,-0.75; 5 0.985,-0.75; 6 0.985,-0.25; 7 0.985,0.25; 8 0.985,0.75 | smd 0.9 x 1.3: 9 0,0

### Placement (x,y rotation side)
BOOT_BUTTON  24.01,108.79 180 top
C1  156.31,5.86 90 top
C1_BAT  119.47,36.78 0 top
C1_BAT1  136.64,26.23 270 top
C1_BAT2  126.6,24.07 0 top
C2  155.19,5.86 90 top
C2_BAT  131.8,39.83 270 top
C3  133.73,26.13 90 top
C4  95.57,35.62 90 top
C4_USB  150.53,53.33 90 top
C5  52.82,108.38 270 top
C5_USB  158.01,54.68 90 top
C6  27.82,108.36 90 top
C7  79.86,30.76 0 top
C8  89.4,48.62 0 top
C9  5.75,99.36 270 top
C10  67.4,108.37 270 top
C10_SUPERCAP  94.77,51.93 270 top
C_DELAY  49.78,99.18 90 top
CHANGE_BUTTON  64,108.8 180 top
CHG_LED  123.72,38.36 90 top
D1  155.25,52.9 0 top
D2  124.71,27.11 90 top
D3  90.92,37.6 0 top
D4  95.88,31.51 0 top
D5  78.32,40.21 90 top
D6  74.84,28.1 0 top
D7  88.25,65.07 0 top
D8  14.04,98.32 0 top
D9  35.5,40.6 90 top
D10  52.08,20.6 270 top
D11  46.26,20.7 270 top
D12  40.34,20.6 270 top
EPD_C1  97.24,19.28 90 top
EPD_C2  94.15,19.28 90 top
EPD_C5  91.11,19.42 90 top
EPD_C6  88.06,19.28 90 top
EPD_C7  85.47,19.38 90 top
EPD_C8  82.48,19.38 90 top
EPD_C9  79.39,19.38 90 top
EPD_C10  77.91,19.42 90 top
EPD_C11  71.07,16.3 90 top
EPD_C12  72.65,16.32 90 top
IC1  45.97,99.18 0 top
IC4  129.1,27.34 0 top
J1  83.4,13.47 0 top
J2  168.1,54.31 90 top
J3  165.25,19.21 90 top
J4  5.08,96 270 top
L1  81.39,34.13 0 top
MCP73831  128.11,37.67 90 top
PFMF.050.1  154.42,46.48 0 top
Q1  137.03,35.94 0 top
Q2  76.24,32.19 270 top
Q3  68.35,13.81 90 top
R1  21.87,34.94 270 top
R1-PINH  157.41,5.87 90 top
R1-PINH1  88.24,63.18 0 top
R1_BAT  119.44,38.43 0 top
R1_PWRUSB  123.14,27.21 90 top
R2  67.83,10.74 0 top
R2-PINH  158.51,5.87 90 top
R2-PINH1  93.28,60.58 270 top
R2-USB  155.88,49.17 0 top
R2-USB1  155.88,50.24 0 top
R2_BAT  123.97,34.47 270 top
R3  70.98,8.86 90 top
R4  71.69,12.54 0 top
R5  32.81,40.64 270 top
R6  52.03,16.14 270 top
R7  45.95,16.14 90 top
R8  40.37,16.14 90 top
R9  67.39,32.34 270 top
R10  7.14,99.37 270 top
R_BOOT  20.2,108.36 270 top
R_CAPACITOR  92.33,51.73 270 top
R_CHANGE  60.19,108.37 270 top
R_CL1  71.93,32.36 270 top
R_RESET  45.2,108.38 270 top
RESET_BUTTON  49.01,108.81 180 top
SENSOR2  157.23,15.79 0 top
SJ1  67.82,8.82 0 top
TP1  16.82,63.12 0 top
TP2  12.54,63.12 0 top
TP3  143.7,43.77 0 top
TP4  128.79,48.31 0 top
TP5  143.49,39.79 0 top
TP6  13.59,76.19 0 top
TP7  8.51,76.19 0 top
TP8  3.43,76.19 0 top
TP9  127.08,13.66 0 top
TP10  127.06,9.28 0 top
TP11  114.1,13.69 0 top
TP12  120.71,9.28 0 top
TP13  114.36,9.28 0 top
TP14  128.7,43.9 0 top
TP15  82.47,66.88 0 top
TP16  11.11,34.25 0 top
TP17  120.45,13.69 0 top
U1  36.83,49.53 0 top
U2  12.7,49.53 90 top
U3  84.86,56.29 270 top
U4  139.57,40.2 0 top

### Tracks (layer width: path | path; a pad name or v marks a point on that pad's centre or on a via)
3V3  (via drill 0.3)
  Top 0.3: 45.38,107.2 45.38,107.62 45.25,107.62 R_RESET.2 45.5,107.62 45.8,107.62 | 45.38,107.2 45.38,99.75 45.12,99.5 44.88,99.5 44.62,99.25 IC1.2 | v53.62,107.62 60.12,107.62 R_CHANGE.2 | 45.8,107.62 v46.12,107.62 | R10.2 7.12,98.75 5.88,100 C9.1 5.88,100.12 6.31,100.56 | 6.31,100.56 6.5,100.75 13.25,100.75 20.12,107.62 R_BOOT.2 | v6,90.88 5.38,90.88 5,90.5 J4.P4 | v6,100.75 6.12,100.62 6.25,100.62 6.31,100.56 | 41.12,16.75 45.88,16.75 R7.2 46,16.75 50.75,16.75 52,15.5 R6.2 | 41.12,16.75 40.38,16.75 R8.2 | 20.5,34.25 TP16.TP 11.12,34.38 9.5,34.38 8.75,35.12 8.75,40.75 U2.2 8.62,40.88 8.62,42.75 v7.5,43.88 | 20.5,34.25 21.75,34.25 R1.2 | 41.12,16.75 41.12,15.1 41.1,15.07 41.1,15.03 40.82,14.75 39.88,14.75 23.94,30.69 | 23.94,30.69 20.5,34.12 20.5,34.25 | v126,24.88 126,24.12 C1_BAT2.1 | v129.38,28.25 130.5,28.25 IC4.5 | J3.2 165.12,18.75 144.75,18.75 137.25,26.25 136,26.25 134.5,24.75 133.75,24.75 C3.+ 133.62,24.75 132.75,24.75 v132.25,25.25 | D7.2 89.25,65 89,65 89,63.25 R1-PINH1.2 88.75,63.12 88.75,62.12 88.12,61.5 88.12,61 U3.2 88.12,60.88 88.12,60.38 88.88,59.62 88.88,58.9 | R2-PINH1.2 93.25,59.88 93,59.62 89.9,59.62 89.6,59.62 88.88,58.9 | U1.8 40.75,51.38 40.75,50.25 U1.7 40.62,50.12 v39,50.12 | 69.75,31.75 71.88,31.75 R_CL1.2 72,31.75 72.25,32 77.12,32 77.25,32.12 Q2.3 77.38,32.25 v78.25,32.25 | 69.75,31.75 67.5,31.75 R9.2 | 69.75,31.75 69.75,31.88 63.62,38 34.75,38 32.88,39.88 R5.2 33,39.88 v33.88,40.75 | v33.88,48.75 33.12,48.75 33,48.88 U1.3 | v88.88,54 88.88,58.9 | 23.94,30.69 v27.62,34.38 | 45.8,107.62 45.38,107.2
  Bottom 0.3: v53.62,107.62 v46.12,107.62 37,107.62 36.25,108.38 13.75,108.38 6.12,100.75 v6,100.75 v6,90.88 6,63.88 3.75,61.62 3.75,61.38 7.5,57.62 v7.5,43.88 | v132.25,25.25 129.38,28.12 v129.38,28.25 v126,24.88 115.62,24.88 87.81,52.69 | v88.88,54 88.88,53.75 87.81,52.69 | 87.81,52.69 82.62,47.5 82.62,37.33 78.25,32.95 v78.25,32.25 | v27.62,34.38 33.88,40.62 v33.88,40.75 v33.88,48.75 34,48.75 34.5,49.25 34.96,49.25 35.29,48.92 35.29,48.42 35.82,47.89 36.58,47.89 38.81,50.12 v39,50.12
32KHZ  (via drill 0.3)
  Top 0.15: R2-PINH1.1 93.25,61.12 93.12,61 v90,61 89.38,61 U3.1 | v77.12,50.5 61.5,50.5 56.25,45.25 21.85,45.25 17.62,41.02 17.62,40.8 U2.9
  Bottom 0.15: v77.12,50.5 87.62,61 v90,61
DN
  Top 0.15: 163.62,54.5 163.62,53.75 163.75,53.62 164.38,53.62 J2.B7 | 163.62,54.5 164.38,54.5 J2.A7 | 163.62,54.5 159.25,54.5 159.12,54.62 154.75,54.62 154,53.88 D1.1
DP  (via drill 0.3)
  Top 0.15: J2.A6 164.5,54.12 165,54.12 165.25,54.38 165.25,55 164.5,55 J2.B6 164.38,55 v163.38,55 | v159.75,51.38 154.5,51.38 154,51.88 D1.3
  Bottom 0.15: v163.38,55 v159.75,51.38
EPD_3V3  (via drill 0.3)
  Top 0.3: Q2.2 75.25,31.12 75.5,30.88 79.12,30.88 C7.1 79.25,30.62 v79.25,29.88 | J1.16 81.75,15 82.12,15 J1.15 82.12,14.88 v82.12,14.12 | TP17.TP 120.38,13.75 113.5,20.62 91.62,20.62 91.12,20.12 EPD_C5.2 91,20.12 89.38,20.12 v88.75,20.75 | v81.12,31.62 83.62,34.12 L1.2
  Bottom 0.3: v88.75,20.75 88.56,20.56 | 88.56,20.56 v82.12,14.12 | 88.56,20.56 v79.25,29.88 79.38,29.88 v81.12,31.62
EPD_3V3_C  (via drill 0.3)
  Top 0.3: v47.75,57.25 20.5,57.25 20.25,57.5 20.25,58.25 U2.18 | v71.25,33.75 71.88,33.12 R_CL1.1 72,33.12 75.12,33.12 Q2.1 75.25,33.25 75.25,43.1 82,43.1 84.08,41.02 v84.08,40.25 | v103.62,20 114.25,9.38 TP13.TP
  Bottom 0.3: v71.25,33.75 v47.75,57.25 | v103.62,20 103.62,20.38 84.08,39.92 v84.08,40.25
EPD_BUSY  (via drill 0.3)
  Top 0.15: v86.75,16.25 85.47,16.25 85.12,15.9 85.12,15 J1.9 | v124.5,16.25 127,13.75 TP9.TP | v83.25,45.62 77.38,51.5 69.75,51.5 65,56.25 10.65,56.25 10,56.9 10,58.25 U2.26
  Bottom 0.15: v124.5,16.25 90.75,16.25 | 90.75,16.25 v86.75,16.25 | v83.25,45.62 83.65,45.23 83.65,34.23 90.75,27.12 90.75,16.25
EPD_CS  (via drill 0.3)
  Top 0.15: v83.62,14.12 83.62,14.88 J1.12 | 76.25,27.38 75.62,28 D6.2 | 66.62,32.12 67.38,32.88 R9.1 | 66.62,32.12 66.62,28.35 67.6,27.38 76.25,27.38 | 76.25,27.38 v76.38,27.25 | 66.62,32.12 61.12,37.62 21.52,37.62 20.25,38.9 20.25,40.75 U2.11 | v91.12,10.62 92.12,10.62 94.75,8 125.75,8 127,9.25 TP10.TP
  Bottom 0.15: 83.5,14.12 83.38,14.12 83.25,14.25 82.88,14.25 82.25,13.62 82,13.62 76.38,19.25 v76.38,27.25 | v91.12,10.62 87,10.62 83.5,14.12 | 83.5,14.12 v83.62,14.12
EPD_DC  (via drill 0.3)
  Top 0.15: v87.75,13.62 84.7,13.62 84.25,14.07 84.25,14.88 J1.11 84.12,15 84.12,15.38 v83.38,16.12 | v112.62,13.62 114,13.62 TP11.TP | v76.88,21.5 72,21.5 58.62,34.88 13.65,34.88 12.62,35.9 12.62,40.75 U2.5
  Bottom 0.15: v112.62,13.62 v87.75,13.62 | v76.88,21.5 76.88,19.62 80.38,16.12 v83.38,16.12
EPD_RST  (via drill 0.3)
  Top 0.15: v88.12,14.12 85.03,14.12 84.75,14.4 84.75,14.88 J1.10 | v115.88,14.12 120.62,9.38 TP12.TP 120.75,9.38 121.75,9.38 121.75,14.12 96.12,39.75 82.12,39.75 v82,39.88 | v65.25,56.62 16.75,56.62 16.38,57 16.38,58.25 U2.21
  Bottom 0.15: v115.88,14.12 v88.12,14.12 | v65.25,56.62 v82,39.88
FLASH_CS  (via drill 0.3)
  Top 0.15: D9.2 35.5,41.25 32.88,41.25 R5.1 32.75,41.38 32.5,41.38 v32,41.88 29.5,39.38 21.93,39.38 21.5,39.8 21.5,40.75 U2.12 | v32.88,50.75 32.88,51.38 U1.1
  Bottom 0.15: v32.88,50.75 32.88,42.75 v32,41.88
GDR
  Top 0.15: J1.2 88.62,14.88 88.62,13.3 88.45,13.12 72.88,13.12 72.38,12.62 R4.2 72.25,12.62 71.38,13.5 68.38,13.5 67.75,12.88 Q3.1
GND  (via drill 0.3, 0.35)
  Top 0.15: J3.1 165.12,17.62 159.38,17.62 158.75,17 SENSOR2.1 158.62,17 158.12,17.5 155.25,17.5 155,17.25 | 155.75,6.5 156.25,6.5 C1.2 | 155.75,6.5 155.25,6.5 C2.2 | 155,16.12 155,15.12 155.25,14.88 155.5,14.88 155.75,14.62 SENSOR2.5 155.75,14.5 155.75,6.5 | 155,16.12 155.75,16.12 SENSOR2.7 | 155,16.12 155,17.25 | 139.5,40 139.62,40.12 U4.9 | 139.5,40 139,39.5 138.62,39.5 U4.4 138.5,39.38 137.75,39.38 | 139.5,40 140.5,40 U4.6 140.62,39.88 143.38,39.88 TP5.TP | 139.5,40 U4.9 | 139,40.88 138.62,40.88 U4.1 | 139,40.88 139.62,40.25 U4.9 | 137.75,39.38 132,39.38 131.88,39.25 C2_BAT.2 | C1_BAT.2 120.12,36.75 120.5,36.38 122.62,36.38 123.88,35.12 R2_BAT.1 124,35.12 127,35.12 | 130.25,36.38 130.25,35.8 129.57,35.12 127,35.12 | 130.25,36.38 130.25,37.12 130.12,37.25 129.88,37.25 129.5,37.62 MCP73831.2 | 126.15,27.25 127.62,27.25 IC4.2 127.75,27.38 133.38,27.38 133.62,27.62 C3.- | 126.15,27.25 123.88,27.25 123.25,26.62 R1_PWRUSB.1 123.12,26.5 124.25,25.38 126.78,25.38 127.25,24.9 C1_BAT2.2 127.25,24 127.88,23.38 136.2,23.38 | 136.2,23.38 136.62,23.38 141.62,18.38 153.88,18.38 155,17.25 | C1_BAT1.2 136.62,25.5 136.62,23.8 136.2,23.38 | 127,35.12 127,28.1 126.15,27.25 | 137.75,39.38 137.75,36.52 137.6,36.38 130.25,36.38 | 91.5,50 90.12,48.62 C8.2 90.12,48.5 v90.12,45.62 | 91.5,50 94,50 94.75,50.75 C10_SUPERCAP.2 94.88,50.75 97.25,48.38 128.75,48.38 TP4.TP 128.88,48.38 129.12,48.62 146.35,48.62 | 91.5,50 85.5,50 U3.13 | J2.B1 164.38,57.38 164.38,57.62 J2.A12 164.5,57.75 164.5,59.38 164.88,59.38 J2.MP4 165,59.38 168.88,59.38 J2.MP2 169,59.38 169,49.25 J2.MP1 168.88,49.25 165,49.25 J2.MP3
  Top 0.15: J2.B12 164.38,51.25 164.38,51 J2.A1 164.5,50.88 164.5,49.25 | 164.5,49.25 164.88,49.25 J2.MP3 | C4_USB.2 150.62,54 151.88,55.25 158,55.25 C5_USB.2 158.12,55.25 158.25,55.12 v158.88,55.12 | 154.62,48.62 154.75,48.5 155.88,48.5 156.5,49.12 R2-USB.2 | 154.62,48.62 154.62,50.12 155.12,50.12 R2-USB1.1 | v157.5,52.75 156.62,52.75 156.5,52.88 D1.5 | 156.75,49.25 v157.5,50 | 156.75,49.25 156.62,49.25 R2-USB.2 | 154.62,48.62 146.35,48.62 | 156.75,49.25 164.5,49.25 | 164.5,49.25 J2.MP3 | 156.75,49.25 R2-USB.2 | 139,40.88 140.38,42.25 144.12,42.25 146.88,45 146.88,48.1 146.35,48.62 | C10.2 67.38,107.75 67.12,108 65.75,108 CHANGE_BUTTON.2 65.75,108.12 62.25,108.12 | 49.75,108.12 50.75,108.12 RESET_BUTTON.2 50.88,108 52.5,108 52.75,107.75 C5.2 52.88,107.75 53.5,108.38 62,108.38 62.25,108.12 | 49.75,108.12 47.38,108.12 RESET_BUTTON.1 | 62.25,108.12 CHANGE_BUTTON.1 | 49.75,108.12 49.75,99.88 C_DELAY.2 49.88,99.75 50.5,99.75 50.5,98.12 50,97.62 45.12,97.62 44.62,98.12 IC1.3 44.5,98.25 44.12,98.62 35.75,98.62 26.25,108.12 | 13.75,91 13.75,87.12 15.38,85.5 J4.G1 15.38,85.38 12.25,82.25 12.25,73 12.38,73 19.12,66.25 19.12,65.4 | 13.75,91 15.38,91 J4.G2 | 26.25,108.12 25.88,108.12 BOOT_BUTTON.2 | 26.25,108.12 26.88,108.12 27.75,109 C6.2 | BOOT_BUTTON.2 25.75,108.12 22.38,108.12 BOOT_BUTTON.1 22.25,108 15.5,101.25 15.5,97.9 15.48,97.88 15.48,97.77 15.36,97.65 13.98,97.65 13.38,98.25 D8.1 13.25,98.25 12.88,97.88 5,97.88 | 2.75,95.62 5,97.88 | 5,97.88 5.75,98.62 C9.2 | 2.75,95.62 2.25,95.62 J4.G4 2.75,95.62 | 2.75,94.62 4.25,93.12 4.5,93.12 4.88,92.75 J4.P6 5,92.62 12.12,92.62 13.75,91
  Top 0.15: 2.75,95.62 2.75,94.62 | 2.75,94.62 1.6,94.62 1.25,94.28 1.25,82.5 J4.G3 | 26.25,108.12 BOOT_BUTTON.2 | 34.75,48.25 35.5,48.25 36.75,49.5 U1.9 | 34.75,48.25 33.62,48.25 33,47.62 U1.4 14.5,47.62 | v34.75,40.62 35.5,39.88 D9.1 | 34.75,48.25 34.75,48.12 v34.62,47.99 | 14.5,47.62 14.5,48 U2.29_8 14.5,48.12 14.5,49.25 U2.29_9 14.38,49.38 13.25,49.38 U2.29_6 13.12,49.38 12,49.38 U2.29_3 11.88,49.38 11.75,49.5 7.5,49.5 7.5,58.25 U2.28 7.5,58.38 7.5,62.38 10.25,65.12 18.9,65.12 | 14.5,47.62 14.5,46.88 U2.29_7 14.38,46.88 13.25,46.88 | 12,46.88 12,48 U2.29_2 | 13.25,46.88 13.25,48 U2.29_5 | 12,46.88 13.12,46.88 U2.29_4 13.25,46.88 | 12,46.88 U2.29_1 11.88,46.75 11.12,46.75 v10.75,46.38 | v7.5,43.12 7.5,40.88 U2.1 | 77.85,28.88 74.88,28.88 74.12,28.12 D6.1 | 77.85,28.88 80.17,28.88 80.5,29.2 C7.2 80.62,30.88 85.5,30.88 92.21,37.59 D3.2 91.36,37.61 v90.12,36.38 | EPD_C1.1 97.12,18.62 94.25,18.62 EPD_C2.1 94.12,18.75 91.12,18.75 EPD_C5.1 91,18.75 88.12,18.75 EPD_C6.1 88,18.62 85.62,18.62 | EPD_C10.1 78,18.75 79.38,18.75 EPD_C9.1 79.5,18.75 82.38,18.75 EPD_C8.1 82.5,18.75 85.38,18.75 EPD_C7.1 | v85.62,15.75 85.62,15 J1.8 | 85.62,18.62 v85.62,16.88 | 85.62,18.62 85.5,18.62 EPD_C7.1 | 85.62,18.62 EPD_C7.1 | J1.17 81.12,14.88 81.12,14.25 74.12,14.25 72.75,15.62 EPD_C12.1 72.62,15.62 71.12,15.62 EPD_C11.1 71,15.62 68.62,15.62 | R2.1 67.12,10.62 67.12,8.88 SJ1.1 | 85.62,12.5 76.75,12.5 J1.MP2 76.62,12.38 76.12,11.88 71.75,11.88 71.12,12.5 R4.1 70.25,11.75 68.25,11.75 67.25,10.75 R2.1 | 85.62,12.5 90.12,12.5 J1.MP1 | 68.62,15.62 68,15.62 66.88,14.5 | 66.88,14.5 66.88,10.75 67.12,10.75 R2.1
  Top 0.15: 66.88,14.5 60.38,21 52.38,21 52.12,21.25 D10.1 52,21.38 46.38,21.38 D11.1 46.25,21.38 40.38,21.38 D12.1 40.25,21.38 v34.75,26.88 | 85.62,12.5 v85.62,12.62 | 68.62,15.62 74,21 77.38,21 77.38,28.4 77.85,28.88
  Top 0.152: 19.12,65.4 19.12,65.35 18.9,65.12 | U1.9 36.83,51.93 38.5,53.6 38.4,53.7 v37.7,53.7 | v49.6,70.8 42.1,63.3 v35.3,63.3 | J4.G2 17.1,91.1 v17.8,90.4 | v82.7,49.1 82.96,49.1 83.99,50.13 84.68,50.13 85,50.45 85,51.14 U3.13 | v54.3,22.4 53.25,21.35 D10.1
  Bottom 0.15: v157.5,50 157.5,52 | 157.5,52 v157.5,52.75 | v158.88,55.12 158.88,54.62 159.38,54.12 159.38,53.88 157.5,52 | v7.5,43.12 v10.75,46.38 | v85.62,16.88 v85.62,15.75 v85.62,12.62 | v34.75,26.88 v34.75,40.62 34.75,47.86 v34.62,47.99 | v90.12,36.38 v90.12,45.62
  Bottom 0.152: v35.3,63.3 36.7,63.3 37.7,62.3 v37.7,53.7
  other vias: 64.9,47.9 100.7,18.1 111.1,18.1 162.6,9.8 16.1,37.1 10.5,38.2 91.6,63.1 22.8,43.8 14.4,62.9 9.9,61.1 11.9,60.5 12.6,56.9 12.6,43.3 15.2,43 17.7,43.2 27,41.4 28.5,38.4 24.3,33.1 159.9,53.7 158.5,11 151.8,34.7 64.3,36 91.5,56.4
  pour Bottom: -13.42,-10.72 249.82,-10.72 249.82,131.22 -13.42,131.22
  pour Top: 249.54,130.34 250.72,131.52 -13.82,131.52 -13.84,131.54 -13.92,131.62 -13.92,-11.97 -13.27,-12.62 248.27,-12.62 249.52,-11.37 249.52,130.32
GPIO8
  Top 0.15: R1.1 21.75,35.62 18.88,38.5 18.88,40.75 U2.10
I2C_PW  (via drill 0.3)
  Top 0.15: 157.38,15.62 157.88,15.62 158.38,16.12 158.62,16.12 SENSOR2.2 | 157.38,15.62 156,15.62 155.88,15.5 SENSOR2.6 | 157.38,15.62 156.25,16.75 156,16.75 155.88,16.88 SENSOR2.8 | R1-PINH.2 157.5,6.5 158.5,6.5 R2-PINH.2 | 156.25,5.25 155.25,5.25 C2.1 155.12,5.25 143.25,5.25 107,41.5 84.1,41.5 82.15,43.45 75.1,43.45 73.15,41.5 v62.75,41.5 | 156.25,5.25 156.88,5.88 157.38,5.88 157.38,6.5 R1-PINH.2 | 156.25,5.25 C1.1 | U2.17 21.5,58.38 21.5,59.38 v21.62,59.5 | 157.38,15.62 157.38,6.62 R1-PINH.2
  Bottom 0.15: v21.62,59.5 29.5,51.62 34.64,51.62 35.92,50.34 35.92,48.69 36.09,48.52 36.31,48.52 39.12,51.32 52.93,51.32 v62.75,41.5
INT_RTC  (via drill 0.3)
  Top 0.15: 87.12,61 86.88,61 U3.3 | 87.12,61 87.3,61 87.5,61.2 87.5,63.12 R1-PINH1.1 87.62,63.25 87.88,63.25 87.88,65.62 87.75,65.75 83.62,65.75 82.5,66.88 TP15.TP | v76.75,51 61.5,51 56.12,45.62 17.7,45.62 16.38,44.3 16.38,40.88 U2.8 | v85.25,59.5 85.38,59.62 85.75,59.62 87.12,61
  Bottom 0.15: v85.25,59.5 v76.75,51
IO/BOOT  (via drill 0.3)
  Top 0.15: R_BOOT.1 20.25,109.12 20.62,109.5 22.25,109.5 BOOT_BUTTON.4 22.38,109.62 25.75,109.62 BOOT_BUTTON.3 25.88,109.62 28.4,109.62 28.5,109.53 28.5,108.38 | 28.5,108.38 27.88,107.75 C6.1 | v24,60.5 24,58.38 U2.15 | v36.12,107.75 35.5,108.38 28.5,108.38
  Bottom 0.15: v24,60.5 24,79.12 44.25,99.38 44.25,99.62 v36.12,107.75
IO/CHANGE
  Top 0.15: R_CHANGE.1 60.25,109.12 60.62,109.5 62.25,109.5 CHANGE_BUTTON.4 62.25,109.62 65.75,109.62 CHANGE_BUTTON.3 65.75,109.5 67,109.5 67.38,109.12 C10.1 67.5,109 68.03,109 68.12,108.9 68.12,107.25 22.75,61.88 14.55,61.88 13.88,61.2 13.88,58.38 U2.23
MISO  (via drill 0.3)
  Top 0.15: 16.38,76.25 13.62,76.25 TP6.TP | J4.P7 5.12,93.75 5.5,93.38 14.25,93.38 15.38,92.25 17.24,92.25 18.68,90.81 18.68,90.58 16.38,88.28 16.38,76.25 | R8.1 40.25,15.5 39.62,16.12 39.62,19.57 39.8,19.75 40.25,19.75 D12.2 40.38,19.88 v41.12,20.62 | v34.75,48.75 33.38,50.12 33,50.12 U1.2 32.88,50.25 15.5,50.25 8.75,57 8.75,58.25 U2.27 8.75,58.38 8.75,63.12 10.38,64.75 19.2,64.75 | 16.38,76.25 16.38,69.5 19.5,66.38 19.5,65
  Top 0.152: 19.5,65 19.25,64.75 19.2,64.75
  Bottom 0.15: v34.75,48.75 34.94,48.56 34.94,48.28 41.12,42.09 v41.12,20.62
MOSI  (via drill 0.3)
  Top 0.15: J4.P3 5.12,89.38 5.62,88.88 6.38,88.88 8.5,86.75 8.5,76.25 TP7.TP 8.62,76.12 v18.62,66.12 | v67.38,13.88 71.5,13.88 71.75,13.62 82.62,13.62 82.62,14.88 J1.14 | v55.62,13.88 54.62,14.88 53.67,14.88 | 53.67,14.88 46.5,14.88 46,15.38 R7.1 | v40.75,46.12 40.75,47.62 U1.5 | D11.2 46.38,20 47,20.62 52.62,20.62 53.25,20 53.25,15.3 53.67,14.88 | v15.88,42 15.12,42 15.12,40.88 U2.7
  Bottom 0.15: v67.38,13.88 55.9,13.88 55.79,13.99 | 18.62,42 23.5,42 32.68,51.18 34.7,51.18 35.65,50.23 35.65,48.57 35.97,48.24 36.43,48.24 38.74,50.55 39.57,50.55 40.75,49.38 v40.75,46.12 40.75,44 55.62,29.12 55.62,14.4 55.7,14.32 55.7,14.07 55.79,13.99 | 18.62,42 v15.88,42 | 18.62,42 v18.62,66.12 | v55.62,13.88 55.74,13.99 55.79,13.99
N$1
  Top 0.15: R_CAPACITOR.1 92.38,52.5 92.38,59.02 92.6,59.25 93.75,59.25 94,59.5 94,65.8 93.05,66.75 84.38,66.75 83,68.12 82,68.12 81.25,67.38 81.25,65.9 82.03,65.12 87.12,65.12 D7.1
N$2
  Top 0.15: R2-USB1.2 156.62,50.25 157.25,50.88 161.5,50.88 163.62,53 164.38,53 J2.A5
N$3
  Top 0.15: R2-USB.1 155.25,49.25 155.5,49.5 155.62,49.5 155.88,49.75 155.88,51 151,51 149.88,52.12 149.88,54.77 151.1,56 164.38,56 J2.B5
N$4
  Top 0.15: 93.75,35.5 95,35.5 95.5,35 C4.1 | D3.1 90.96,37.6 91.56,38.2 93.33,38.2 93.75,37.78 93.75,35.5 | D4.2 95.39,31.51 93.75,33.15 93.75,35.5
N$5
  Top 0.15: D2.1 124.75,26.12 125,26.38 127.62,26.38 IC4.3 127.75,26.38 128.25,25.88 135.12,25.88 136.12,26.88 136.62,26.88 C1_BAT1.1 136.75,27 136.75,28.88 136.75,29.5 | Q1.2 137.88,34.88 137.3,34.88 136.75,34.33 136.75,29.5 | IC4.1 127.75,28.38 128.25,28.88 135.9,28.88 136.12,28.88 136.75,29.5
N$7
  Top 0.15: R1_BAT.2 120.12,38.38 121.25,37.25 128.62,37.25 129.12,36.75 129.38,36.75 MCP73831.1
N$8
  Top 0.15: R2_BAT.2 123.88,33.88 123,34.75 121,34.75 119.5,36.25 119.5,37.25 119.69,37.43 119.83,37.43 119.9,37.5 120.5,37.5 121.25,36.75 126.75,36.75 MCP73831.5
N$9
  Top 0.15: C_DELAY.1 49.75,98.62 48.25,100.12 IC1.5
N$10
  Top 0.15: CHG_LED.C 122.88,38.38 122.12,39.12 119.5,39.12 118.88,38.5 R1_BAT.1
N$13
  Top 0.15: 98.38,19.5 98.38,18.12 97.88,17.62 88.28,17.62 87.75,17.1 87.75,15 J1.4 | 98,19.88 97.25,19.88 EPD_C1.2
  Top 0.152: 98.38,19.5 98,19.88
N$14
  Top 0.15: 98,19 98,18.25 97.75,18 87.6,18 87.25,17.65 87.25,15 J1.5 | 97.9,19.38 94.75,19.38 94.25,19.88 EPD_C2.2
  Top 0.152: 98,19 97.9,19.1 97.9,19.38
N$15  (via drill 0.3)
  Top 0.15: v83.88,16.62 81.28,16.62 80.75,16.1 80.75,15 J1.18 | v87.12,19.88 88,19.88 EPD_C6.2
  Bottom 0.15: v83.88,16.62 v87.12,19.88
N$16  (via drill 0.3)
  Top 0.15: v80.25,16.88 80.25,15 J1.19 | v83.38,20 85.38,20 EPD_C7.2
  Bottom 0.15: v83.38,20 v80.25,16.88
N$17
  Top 0.15: 78.62,17.5 78.62,15 J1.22 | 78,18.12 77.38,18.12 77.25,18.25 77.25,20 77.88,20 EPD_C10.2
  Top 0.152: 78,18.12 78.62,17.5
N$18  (via drill 0.3)
  Top 0.15: v79.75,17.38 79.75,15 J1.20 | v81.75,19.38 82.38,20 EPD_C8.2
  Bottom 0.15: v81.75,19.38 v79.75,17.38
N$23
  Top 0.15: J1.24 77.62,15 75.75,16.88 72.75,16.88 EPD_C12.2
PREVGH  (via drill 0.3)
  Top 0.15: v79.25,18 79.25,15 J1.21 | v80.5,19.25 79.75,20 79.5,20 EPD_C9.2 | v79,37.25 78.77,37.48 77.74,37.48 77.62,37.6 77.62,39.02 78.32,39.72 D5.2
  Bottom 0.15: v79.25,18 v80.5,19.25 77.75,22 77.75,32.95 79,34.2 v79,37.25
PREVGL
  Top 0.15: 78.12,17 78.12,15 J1.23 | 74.38,17.62 71.75,17.62 71.12,17 EPD_C11.2 | 77.5,17.62 74.38,17.62 | 74.38,17.62 77.38,20.62 82.38,20.62 94.12,32.37 D4.1
  Top 0.152: 78.12,17 77.5,17.62
RESE  (via drill 0.3)
  Top 0.15: 71.62,10.25 71,9.62 R3.2 | 71.62,10.25 71.75,10.38 90.2,10.38 90.62,10.8 90.62,14.38 89.38,15.62 88.25,15.62 88.25,15 J1.3 | v69.62,12.25 69.5,12.25 Q3.2 | 71.62,10.25 v71,10.88
  Bottom 0.15: v71,10.88 v69.62,12.25
RESE'
  Top 0.15: R3.1 70.88,8.25 70.38,8.75 68.62,8.75 SJ1.2 68.5,8.88 68.5,10.62 R2.2
RESET  (via drill 0.3)
  Top 0.15: C5.1 52.75,109.12 52.38,109.5 50.88,109.5 RESET_BUTTON.3 50.75,109.62 47.38,109.62 RESET_BUTTON.4 47.25,109.5 46.88,109.12 45.25,109.12 R_RESET.1 45.12,109 44.8,109 | 44.5,108.5 44.5,100.25 IC1.1 44.5,100.12 44.38,100.12 v43.75,99.5 | v10,44.12 10,40.88 U2.3
  Top 0.152: 44.5,108.5 44.5,108.7 44.8,109
  Bottom 0.15: v10,44.12 18.12,52.25 18.12,73.88 v43.75,99.5
RTC_RST  (via drill 0.3)
  Top 0.15: v23.5,59.5 23,59.5 22.75,59.25 22.75,58.38 U2.16 | v84.38,59.5 85.38,60.5 85.38,60.88 U3.4
  Bottom 0.15: v23.5,59.5 30.86,59.5 35.11,63.75 36.64,63.75 40.89,59.5 v84.38,59.5
RX
  Top 0.15: U2.24 12.5,58.38 12.54,58.38 TP2.TP
SCK  (via drill 0.3)
  Top 0.15: v83.12,13.75 83.12,14.88 J1.13 | v52.75,16.12 52.12,16.75 R6.1 52.12,16.88 52.12,19.75 D10.2 | J4.P5 5,91.5 4.62,91.12 4,91.12 3.5,90.62 3.5,76.25 TP8.TP 3.5,76.12 3.5,62 4,61.5 v4.38,61.5 | 13.88,43.62 16.25,46 37.75,46 v38,46.25 40.62,48.88 U1.6 | 13.88,43.62 13.88,40.88 U2.6 | v11.25,46 13.62,43.62 13.88,43.62
  Bottom 0.15: v83.12,13.75 82.88,13.75 82.38,13.25 55.62,13.25 v52.75,16.12 52.75,31.5 v38,46.25 | v4.38,61.5 4.38,61.25 11.25,54.38 v11.25,46
SCL  (via drill 0.3)
  Top 0.15: 159.25,14.5 159.25,5.88 158.62,5.25 R2-PINH.1 | 159.25,14.5 158.75,14.5 SENSOR2.4 | U4.7 140.62,40.5 v141.38,40.5 142.5,40.5 143,41 144.86,41 165.15,20.71 J3.4 165.25,20.62 166.25,20.62 166.25,17.38 163.88,15 159.75,15 159.25,14.5 | U2.20 17.62,58.38 17.62,60.3 18.32,61 78.75,61 86.12,53.62 88.62,53.62 89.25,53 89.25,51.75 U3.16 89.38,51.62 89.62,51.62 v90,51.25
  Bottom 0.15: v141.38,40.5 100.75,40.5 v90,51.25
SDA  (via drill 0.3)
  Top 0.15: 140.75,41.12 141,41.38 146,41.38 166.62,20.75 v166.62,15.5 166.62,6.1 | 140.75,41.12 140.62,41 U4.8 | 165.5,4.62 158,4.62 157.5,5.12 R1-PINH.1 | v163.75,15.5 158.75,15.5 SENSOR2.3 | v164.12,19.38 164.88,19.38 165.12,19.62 J3.3 | v23.12,60 19.48,60 18.88,59.4 18.88,58.38 U2.19 | v79.12,60 85.88,53.25 86.75,53.25 87.88,52.12 | 87.88,52.12 88,52 88,51.75 U3.15 87.88,52.12 | 140.75,41.12 140.38,41.5 v140.25,41.5 | v88.75,52.88 88,52.12 87.88,52.12
  Top 0.152: 166.62,6.1 166.62,5.75 165.5,4.62
  Bottom 0.15: v166.62,15.5 164.12,15.5 | 164.12,15.5 v163.75,15.5 | 164.12,15.5 v164.12,19.38 | v140.25,41.5 100.38,41.5 89,52.88 v88.75,52.88 | v23.12,60 30.97,60 35,64.03 36.76,64.03 40.78,60 v79.12,60
SRC  (via drill 0.3)
  Top 0.15: v69,15.12 68.62,15.12 68.38,14.88 Q3.3 | 79.12,34.12 78.88,34.12 78.78,34.03 v78.22,34.03 | 79.12,34.12 79.12,35.62 82.5,39 78.87,39 D5.1 78.91,39 92.92,39 95.57,36.35 C4.2 | 79.12,34.12 L1.1
  Bottom 0.15: v78.22,34.03 78.22,33.81 69,24.59 v69,15.12
SS_SD  (via drill 0.3)
  Top 0.15: 8.25,99 7.25,100 R10.1 | 8.25,99 8.5,99 14.12,99 14.75,98.38 D8.2 | U2.4 11.25,45.5 11,45.5 6.38,50.12 6.38,88 | 6.38,88 6.38,88.25 5.5,88.25 J4.P2 | v8.25,98.38 8.25,99 | 6.38,88 v6.62,88
  Bottom 0.15: v8.25,98.38 8.25,89.62 v6.62,88
TX
  Top 0.15: U2.25 11.25,59.6 11.25,60.9 11.25,62 11.12,62 10.5,62.62 10.5,63.8 | 11.1,64.38 15.5,64.38 16.75,63.12 TP1.TP
  Top 0.152: 11.1,64.38 10.53,63.8 10.5,63.8
USB_D+  (via drill 0.3)
  Top 0.15: v158.88,54 158.88,53.5 157.62,52.25 156.75,52.25 156.5,52 D1.4 | v74.88,47.62 72.75,45.5 57,45.5 54.25,42.75 25.88,42.75 24,40.88 U2.14
  Bottom 0.15: v158.88,54 155.38,54 154.88,54.5 81.75,54.5 v74.88,47.62
USB_D-  (via drill 0.3)
  Top 0.15: v155,53.75 156.5,53.75 D1.6 | v146.38,45.12 57.12,45.12 54.38,42.38 27.12,42.38 24.5,39.75 23.38,39.75 22.75,40.38 22.75,40.75 U2.13
  Bottom 0.15: v146.38,45.12 v155,53.75
VBAT
  Top 0.15: U4.3 138.62,40 138.62,40.38 U4.2 138.5,40.5 137.25,40.5 | 130,38.62 131.75,40.38 C2_BAT.1 131.88,40.5 137.25,40.5 | 130,38.62 129.5,38.62 MCP73831.3 130,38.62 | 130,38.62 135.5,38.62 137,37.12 Q1.3 | 137.25,40.5 139.38,42.62 142.5,42.62 143.62,43.75 TP3.TP
VBUS  (via drill 0.3)
  Top 0.3: C4_USB.1 150.62,52.75 150.75,52.88 154,52.88 D1.2 154.12,52.88 154.88,52.88 v155,53 | v157.88,53.25 158,53.25 158,54 C5_USB.1 | v155.12,48 156.62,46.5 PFMF.050.1.2 | 123.5,28.12 123.25,27.88 R1_PWRUSB.2 | 123.5,28.12 124.62,28.12 D2.2 | v130.75,35 136,35 Q1.1 | v127.75,38 127.25,38.5 126.88,38.5 MCP73831.4 126.75,38.5 124.62,38.5 124.5,38.38 CHG_LED.A 124.38,38.38 123.69,39.06 | 123.69,39.06 123.25,39.5 118.6,39.5 118,38.9 118,37.62 118.75,36.88 C1_BAT.1 118.88,36.75 118.88,32.88 123.5,28.25 123.5,28.12 | TP14.TP 128.62,43.88 123.88,39.12 123.75,39.12 123.69,39.06
  Bottom 0.3: v157.88,53.25 157.75,53.25 157.62,53.38 155.38,53.38 v155,53 155.12,53 v155.12,48 150,48 137,35 v130.75,35 v127.75,38
VRTC
  Top 0.15: C10_SUPERCAP.1 94.75,53 94.25,53 R_CAPACITOR.2 91.62,50.38 87.62,50.38 86.88,51.12 86.88,51.62 U3.14 86.75,51.75 86.75,52 85.88,52.88 85.3,52.88 85.29,52.86 85.16,52.86 84.72,52.42 84.72,50.57 84.56,50.41 83.37,50.41 82.25,49.29 82.25,48.91 82.51,48.65 82.9,48.65 83.88,49.62 87.75,49.62 C8.1
VUSB  (via drill 0.3)
  Top 0.3: J2.A9 164.38,56.75 164.38,56.62 J2.B4 164.5,56.5 165.62,56.5 165.62,52.62 165.12,52.12 164.5,52.12 J2.B9 164.38,52 164.38,51.88 J2.A4 164.25,51.88 164.12,51.75 162.88,51.75 161,49.88 v158.12,49.88 | v154.75,46.5 152.25,46.5 PFMF.050.1.1
  Bottom 0.3: v154.75,46.5 v158.12,49.88

### Text on the board
tPlace: OpenBook v1.1 APR 2025 | Serial No: